# EAGLE design lisa_m (EAGLE 6.1)

## Sheet 1 of 3
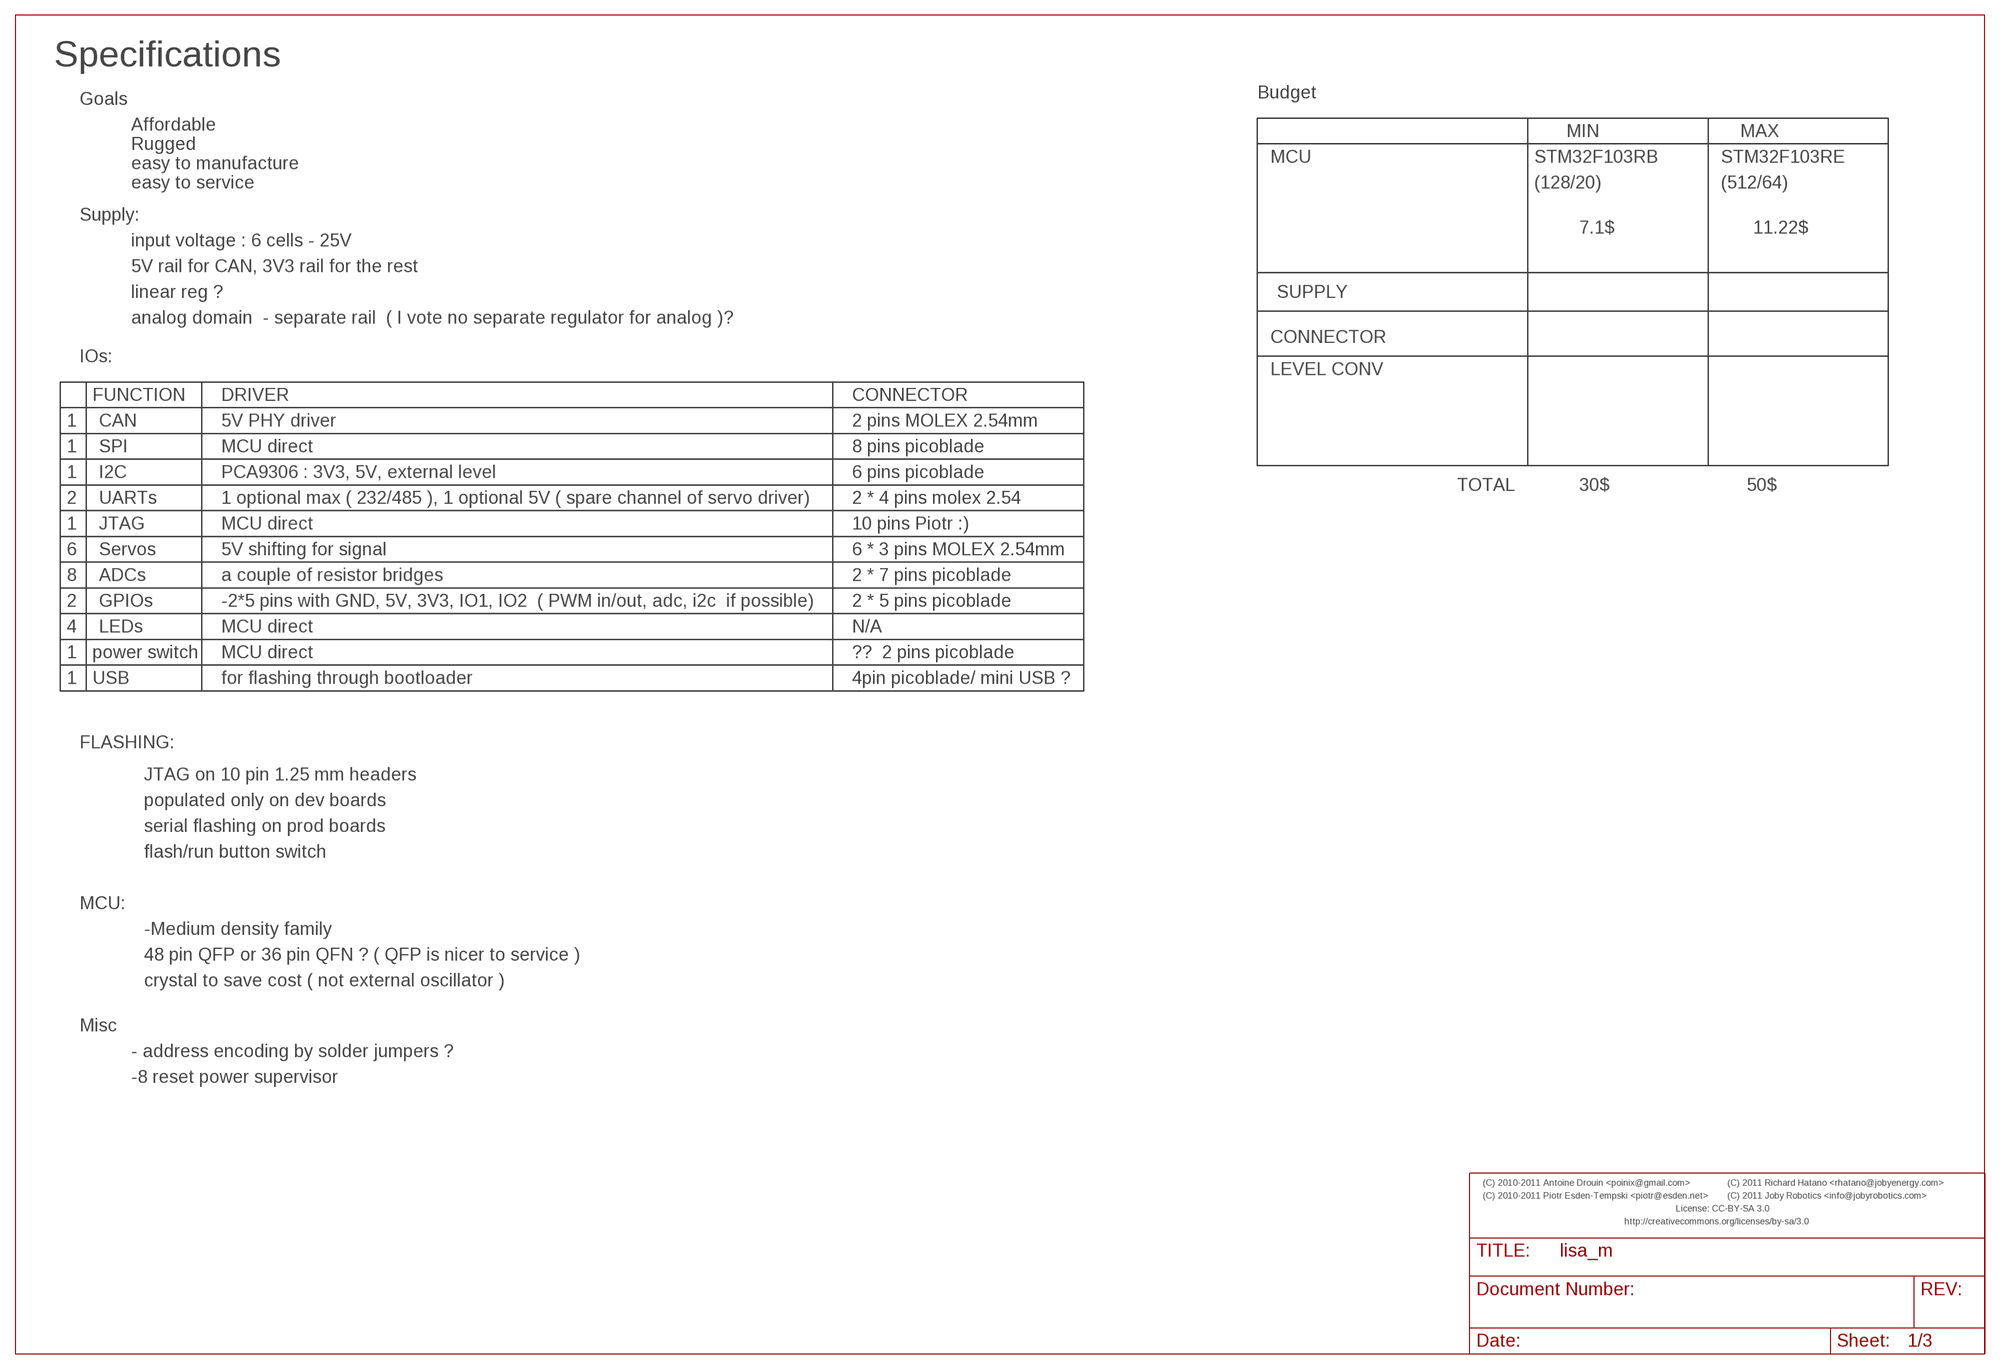
[diagram p0: schematic, sheet 1]

### Notes on the sheet
- Specifications
- Budget
- Goals
- Affordable
- MIN | MAX
- Rugged
- MCU | STM32F103RB | STM32F103RE
- easy to manufacture
- easy to service | (128/20) | (512/64)
- Supply:
- 7.1$ | 11.22$
- input voltage : 6 cells - 25V
- 5V rail for CAN, 3V3 rail for the rest
- linear reg ? | SUPPLY
- analog domain  - separate rail  ( I vote no separate regulator for analog )?
- CONNECTOR
- IOs:
- LEVEL CONV
- FUNCTION | DRIVER | CONNECTOR
- 1 | CAN | 5V PHY driver | 2 pins MOLEX 2.54mm
- 1 | SPI | MCU direct | 8 pins picoblade
- 1 | I2C | PCA9306 : 3V3, 5V, external level | 6 pins picoblade
- TOTAL | 30$ | 50$
- 2 | UARTs | 1 optional max ( 232/485 ), 1 optional 5V ( spare channel of servo driver) | 2 * 4 pins molex 2.54
- 1 | JTAG | MCU direct | 10 pins Piotr :)
- 6 | Servos | 5V shifting for signal | 6 * 3 pins MOLEX 2.54mm
- 8 | ADCs | a couple of resistor bridges | 2 * 7 pins picoblade
- 2 | GPIOs | -2*5 pins with GND, 5V, 3V3, IO1, IO2  ( PWM in/out, adc, i2c  if possible) | 2 * 5 pins picoblade
- 4 | LEDs | MCU direct | N/A
- 1 | power switch | MCU direct | ??  2 pins picoblade
- 1 | USB | for flashing through bootloader | 4pin picoblade/ mini USB ?
- FLASHING:
- JTAG on 10 pin 1.25 mm headers
- populated only on dev boards
- serial flashing on prod boards
- flash/run button switch
- MCU:
- -Medium density family
- 48 pin QFP or 36 pin QFN ? ( QFP is nicer to service )
- crystal to save cost ( not external oscillator )
- Misc
- - address encoding by solder jumpers ?
- -8 reset power supervisor
- (C) 2010-2011 Antoine Drouin <poinix@gmail.com> | (C) 2011 Richard Hatano <rhatano@jobyenergy.com>
- (C) 2010-2011 Piotr Esden-Tempski <piotr@esden.net> | (C) 2011 Joby Robotics <info@jobyrobotics.com>
- License: CC-BY-SA 3.0
- http://creativecommons.org/licenses/by-sa/3.0

## Sheet 2 of 3
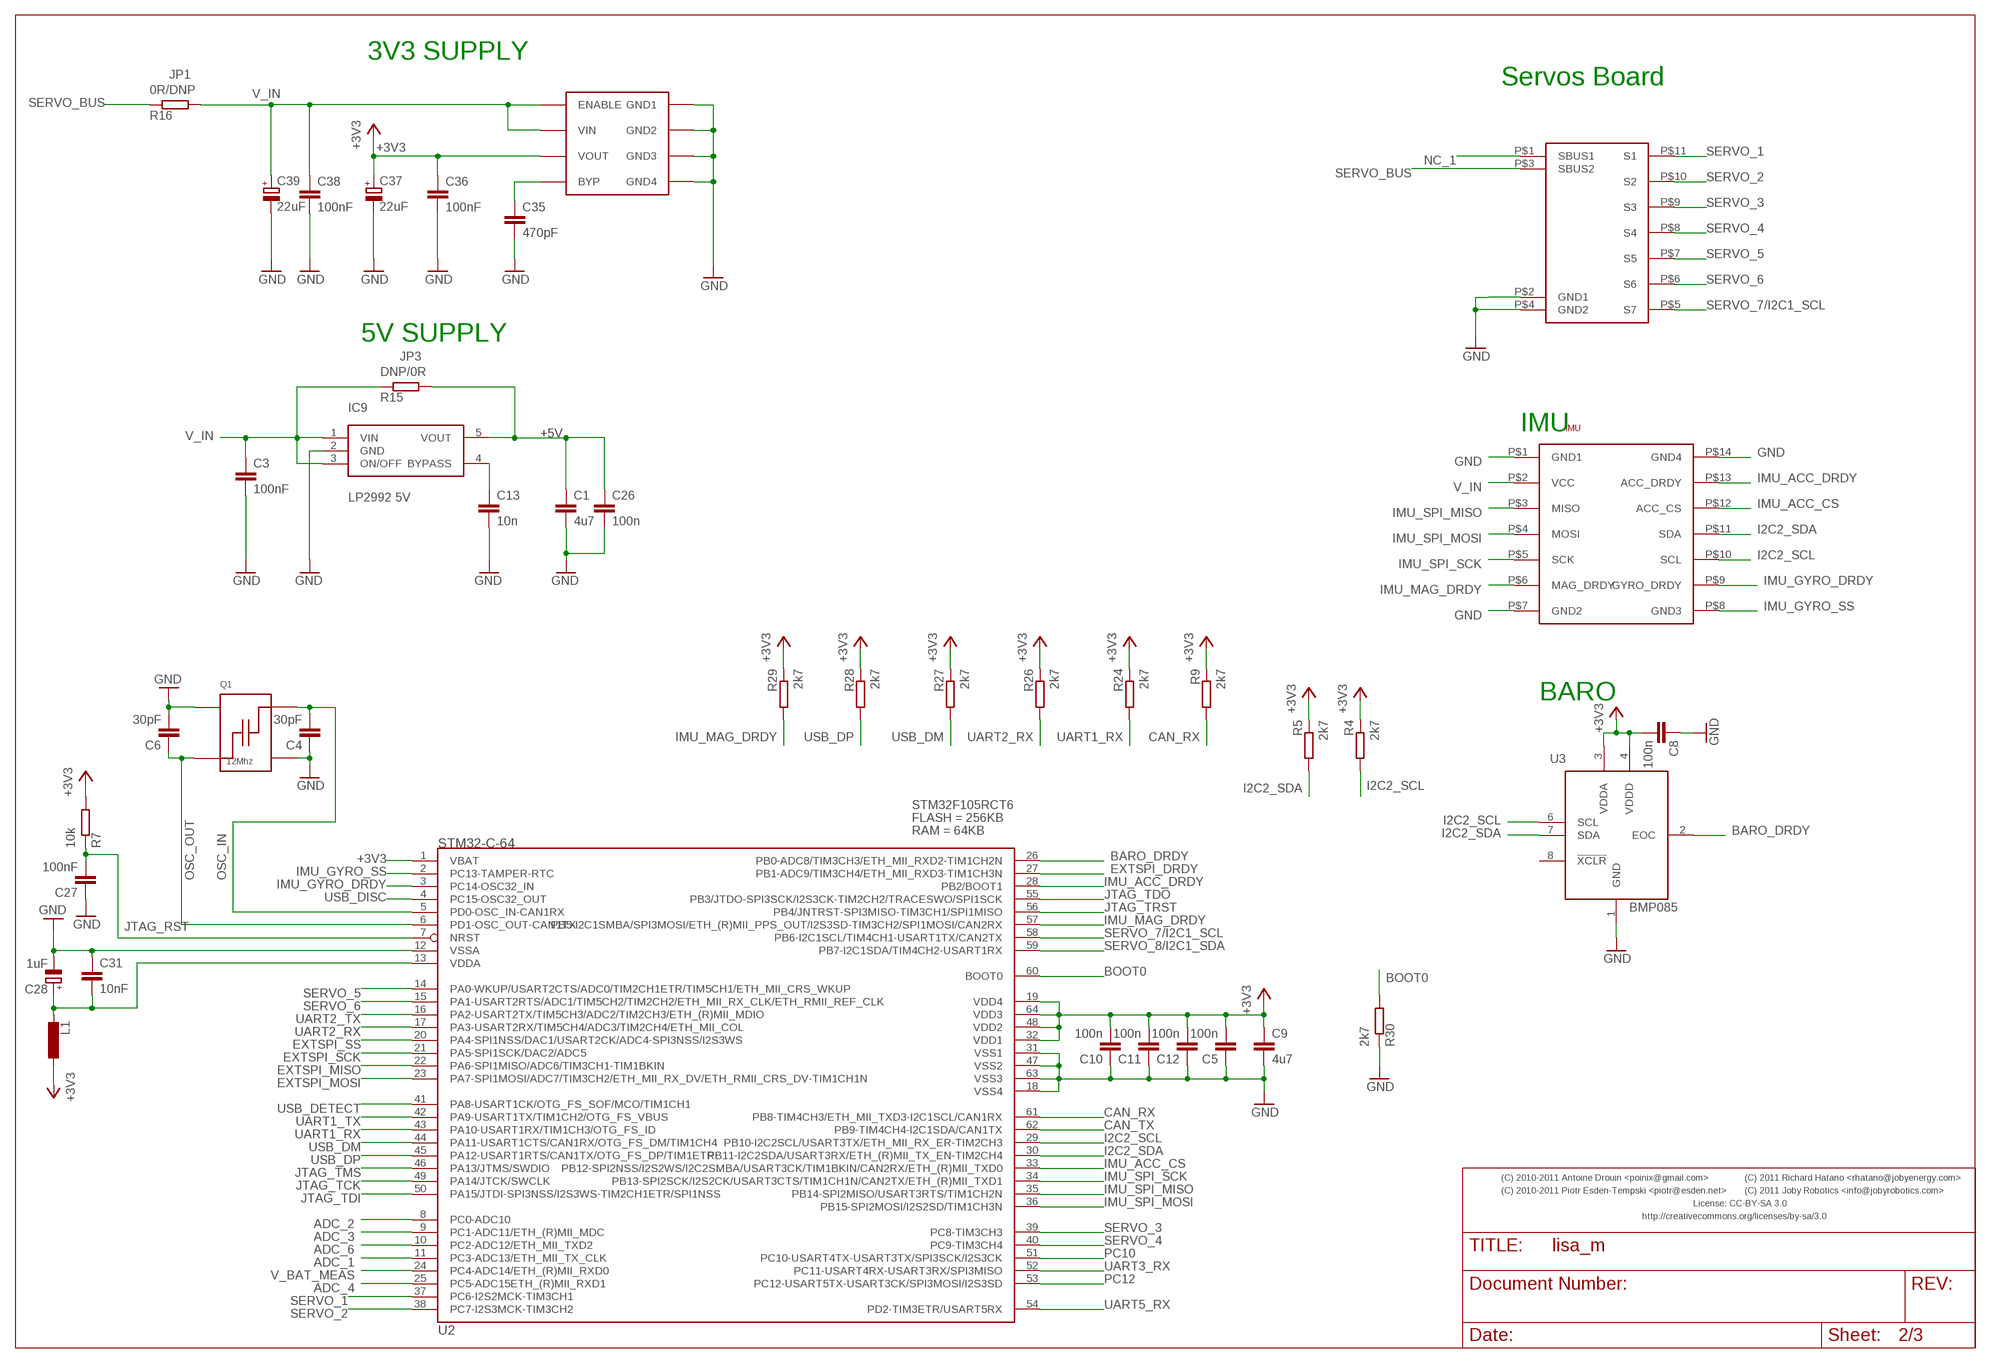
[diagram p1: schematic, sheet 2]

### Parts
C1  4u7  CAPACITOR-0805  [0805-CAP]
C3  100nF  CAPACITOR-0603  [0603-CAP]
C4  30pF  CAPACITOR-0402  [0402-CAP]
C5  100n  CAPACITOR-0402  [0402-CAP]
C6  30pF  CAPACITOR-0402  [0402-CAP]
C8  100n  CAPACITOR-0402  [0402-CAP]
C9  4u7  CAPACITOR-0805  [0805-CAP]
C10  100n  CAPACITOR-0402  [0402-CAP]
C11  100n  CAPACITOR-0402  [0402-CAP]
C12  100n  CAPACITOR-0402  [0402-CAP]
C13  10n  CAPACITOR-0402  [0402-CAP]
C26  100n  CAPACITOR-0603  [0603-CAP]
C27  100nF  CAPACITOR-0402  [0402-CAP]
C28  1uF  CAPACITOR-POL-0603  [0603-POL-CAP]
C31  10nF  CAPACITOR-0402  [0402-CAP]
C35  470pF  CAPACITOR-0402  [0402-CAP]
C36  100nF  CAPACITOR-0603  [0603-CAP]
C37  22uF  CAPACITOR-POLB  [3528/B]
C38  100nF  CAPACITOR-0402  [0402-CAP]
C39  22uF  CAPACITOR-POLB  [3528/B]
IC9  LP2992 5V  LP2992  [SOT23-5]
IMU  ASPIRIN  [ASPIRIN_1]
L1  INDUCTOR-0603  [0603-IND]
Q1  12Mhz  ABM8  [ABM8]
R4  2k7  RESISTOR-0402  [0402-RES]
R5  2k7  RESISTOR-0402  [0402-RES]
R7  10k  RESISTOR-0402  [0402-RES]
R9  2k7  RESISTOR-0402  [0402-RES]
R15  DNP/0R  RESISTOR-0402  [0402-RES]
R16  0R/DNP  RESISTOR-0402  [0402-RES]
R24  2k7  RESISTOR-0402  [0402-RES]
R26  2k7  RESISTOR-0402  [0402-RES]
R27  2k7  RESISTOR-0402  [0402-RES]
R28  2k7  RESISTOR-0402  [0402-RES]
R29  2k7  RESISTOR-0402  [0402-RES]
R30  2k7  RESISTOR-0402  [0402-RES]
U2  STM32-C-64  [LQFP64]
U3  BMP085  [LCC8]
U$1  LISA_M_VBOARD  [LISA_M_VBOARD]
VREG1  MIC5209  [SOIC8]

### Nets
+3V3: C5.P$2 C8.P$2 C9.P$1 C10.P$2 C11.P$2 C12.P$2 C36.P$1 C37.+ L1.P$1 R4.P$1 R5.P$1 R7.P$2 R9.P$1 R24.P$1 R26.P$1 R27.P$1 R28.P$1 R29.P$1 U2.1(VBAT) U2.19(VDD4) U2.32(VDD1) U2.48(VDD2) U2.64(VDD3) U3.3(VDDA) U3.4(VDDD) VREG1.3(VOUT) ; also sheet 3
+5V: C1.P$1 C26.P$1 IC9.5(VOUT) R15.P$2 ; also sheet 3
ADC_1: U2.11(PC3-ADC13/ETH_MII_TX_CLK) ; also sheet 3
ADC_2: U2.8(PC0-ADC10) ; also sheet 3
ADC_3: U2.9(PC1-ADC11/ETH_(R)MII_MDC) ; also sheet 3
ADC_4: U2.25(PC5-ADC15ETH_(R)MII_RXD1) ; also sheet 3
ADC_6: U2.10(PC2-ADC12/ETH_MII_TXD2) ; also sheet 3
BARO_DRDY: U2.26(PB0-ADC8/TIM3CH3/ETH_MII_RXD2-TIM1CH2N) U3.2(EOC)
BOOT0: R30.P$2 U2.60(BOOT0) ; also sheet 3
CAN_RX: R9.P$2 U2.61(PB8-TIM4CH3/ETH_MII_TXD3-I2C1SCL/CAN1RX) ; also sheet 3
CAN_TX: U2.62(PB9-TIM4CH4-I2C1SDA/CAN1TX) ; also sheet 3
EXTSPI_DRDY: U2.27(PB1-ADC9/TIM3CH4/ETH_MII_RXD3-TIM1CH3N) ; also sheet 3
EXTSPI_MISO: U2.22(PA6-SPI1MISO/ADC6/TIM3CH1-TIM1BKIN) ; also sheet 3
EXTSPI_MOSI: U2.23(PA7-SPI1MOSI/ADC7/TIM3CH2/ETH_MII_RX_DV/ETH_RMII_CRS_DV-TIM1CH1N) ; also sheet 3
EXTSPI_SCK: U2.21(PA5-SPI1SCK/DAC2/ADC5) ; also sheet 3
EXTSPI_SS: U2.20(PA4-SPI1NSS/DAC1/USART2CK/ADC4-SPI3NSS/I2S3WS) ; also sheet 3
GND: C1.P$2 C3.P$2 C4.P$1 C5.P$1 C6.P$2 C8.P$1 C9.P$2 C10.P$1 C11.P$1 C12.P$1 C13.P$2 C26.P$2 C27.P$1 C28.- C31.P$1 C35.P$2 C36.P$2 C37.- C38.P$2 C39.- IC9.2(GND) IMU.P$1(GND1) IMU.P$7(GND2) IMU.P$14(GND4) Q1.P$2 Q1.P$4 R30.P$1 U2.12(VSSA) U2.18(VSS4) U2.31(VSS1) U2.47(VSS2) U2.63(VSS3) U3.1(GND) U$1.P$2(GND1) U$1.P$4(GND2) VREG1.5(GND4) VREG1.6(GND3) VREG1.7(GND2) VREG1.8(GND1) ; also sheet 3
I2C2_SCL: IMU.P$10(SCL) R4.P$2 U2.29(PB10-I2C2SCL/USART3TX/ETH_MII_RX_ER-TIM2CH3) U3.6(SCL) ; also sheet 3
I2C2_SDA: IMU.P$11(SDA) R5.P$2 U2.30(PB11-I2C2SDA/USART3RX/ETH_(R)MII_TX_EN-TIM2CH4) U3.7(SDA) ; also sheet 3
IMU_ACC_CS: IMU.P$12(ACC_CS) U2.33(PB12-SPI2NSS/I2S2WS/I2C2SMBA/USART3CK/TIM1BKIN/CAN2RX/ETH_(R)MII_TXD0)
IMU_ACC_DRDY: IMU.P$13(ACC_DRDY) U2.28(PB2/BOOT1)
IMU_GYRO_DRDY: IMU.P$9(GYRO_DRDY) U2.3(PC14-OSC32_IN)
IMU_GYRO_SS: IMU.P$8(GND3) U2.2(PC13-TAMPER-RTC)
IMU_MAG_DRDY: IMU.P$6(MAG_DRDY) R29.P$2 U2.57(PB5-I2C1SMBA/SPI3MOSI/ETH_(R)MII_PPS_OUT/I2S3SD-TIM3CH2/SPI1MOSI/CAN2RX)
IMU_SPI_MISO: IMU.P$3(MISO) U2.35(PB14-SPI2MISO/USART3RTS/TIM1CH2N)
IMU_SPI_MOSI: IMU.P$4(MOSI) U2.36(PB15-SPI2MOSI/I2S2SD/TIM1CH3N)
IMU_SPI_SCK: IMU.P$5(SCK) U2.34(PB13-SPI2SCK/I2S2CK/USART3CTS/TIM1CH1N/CAN2TX/ETH_(R)MII_TXD1)
JTAG_RST: C27.P$2 R7.P$1 U2.7(NRST) ; also sheet 3
JTAG_TCK: U2.49(PA14/JTCK/SWCLK) ; also sheet 3
JTAG_TDI: U2.50(PA15/JTDI-SPI3NSS/I2S3WS-TIM2CH1ETR/SPI1NSS) ; also sheet 3
JTAG_TDO: U2.55(PB3/JTDO-SPI3SCK/I2S3CK-TIM2CH2/TRACESWO/SPI1SCK) ; also sheet 3
JTAG_TMS: U2.46(PA13/JTMS/SWDIO) ; also sheet 3
JTAG_TRST: U2.56(PB4/JNTRST-SPI3MISO-TIM3CH1/SPI1MISO) ; also sheet 3
N$6: C13.P$1 IC9.4(BYPASS)
N$7: C35.P$1 VREG1.4(BYP)
NC_1: U$1.P$1(SBUS1)
OSC_IN: C4.P$2 Q1.P$3 U2.5(PD0-OSC_IN-CAN1RX)
OSC_OUT: C6.P$1 Q1.P$1 U2.6(PD1-OSC_OUT-CAN1TX)
PC10: U2.51(PC10-USART4TX-USART3TX/SPI3SCK/I2S3CK) ; also sheet 3
PC12: U2.53(PC12-USART5TX-USART3CK/SPI3MOSI/I2S3SD) ; also sheet 3
SERVO_1: U2.37(PC6-I2S2MCK-TIM3CH1) U$1.P$11(S1)
SERVO_2: U2.38(PC7-I2S3MCK-TIM3CH2) U$1.P$10(S2)
SERVO_3: U2.39(PC8-TIM3CH3) U$1.P$9(S3)
SERVO_4: U2.40(PC9-TIM3CH4) U$1.P$8(S4)
SERVO_5: U2.14(PA0-WKUP/USART2CTS/ADC0/TIM2CH1ETR/TIM5CH1/ETH_MII_CRS_WKUP) U$1.P$7(S5)
SERVO_6: U2.15(PA1-USART2RTS/ADC1/TIM5CH2/TIM2CH2/ETH_MII_RX_CLK/ETH_RMII_REF_CLK) U$1.P$6(S6)
SERVO_7/I2C1_SCL: U2.58(PB6-I2C1SCL/TIM4CH1-USART1TX/CAN2TX) U$1.P$5(S7) ; also sheet 3
SERVO_8/I2C1_SDA: U2.59(PB7-I2C1SDA/TIM4CH2-USART1RX) ; also sheet 3
SERVO_BUS: R16.P$1 U$1.P$3(SBUS2)
UART1_RX: R24.P$2 U2.43(PA10-USART1RX/TIM1CH3/OTG_FS_ID) ; also sheet 3
UART1_TX: U2.42(PA9-USART1TX/TIM1CH2/OTG_FS_VBUS) ; also sheet 3
UART2_RX: R26.P$2 U2.17(PA3-USART2RX/TIM5CH4/ADC3/TIM2CH4/ETH_MII_COL) ; also sheet 3
UART2_TX: U2.16(PA2-USART2TX/TIM5CH3/ADC2/TIM2CH3/ETH_(R)MII_MDIO) ; also sheet 3
UART3_RX: U2.52(PC11-USART4RX-USART3RX/SPI3MISO) ; also sheet 3
UART5_RX: U2.54(PD2-TIM3ETR/USART5RX) ; also sheet 3
USB_DETECT: U2.41(PA8-USART1CK/OTG_FS_SOF/MCO/TIM1CH1) ; also sheet 3
USB_DISC: U2.4(PC15-OSC32_OUT) ; also sheet 3
USB_DM: R27.P$2 U2.44(PA11-USART1CTS/CAN1RX/OTG_FS_DM/TIM1CH4) ; also sheet 3
USB_DP: R28.P$2 U2.45(PA12-USART1RTS/CAN1TX/OTG_FS_DP/TIM1ETR) ; also sheet 3
V_BAT_MEAS: U2.24(PC4-ADC14/ETH_(R)MII_RXD0) ; also sheet 3
V_IN: C3.P$1 C38.P$1 C39.+ IC9.1(VIN) IC9.3(ON/OFF) IMU.P$2(VCC) R15.P$1 R16.P$2 VREG1.1(ENABLE) VREG1.2(VIN) ; also sheet 3
VDDA: C28.+ C31.P$2 L1.P$2 U2.13(VDDA)
Unconnected: U3.8(!XCLR)

### Notes on the sheet
- 3V3 SUPPLY
- JP1
- Servos Board
- 5V SUPPLY
- JP3
- IMU
- BARO
- (C) 2010-2011 Antoine Drouin <poinix@gmail.com> | (C) 2011 Richard Hatano <rhatano@jobyenergy.com>
- (C) 2010-2011 Piotr Esden-Tempski <piotr@esden.net> | (C) 2011 Joby Robotics <info@jobyrobotics.com>
- License: CC-BY-SA 3.0
- http://creativecommons.org/licenses/by-sa/3.0

## Sheet 3 of 3
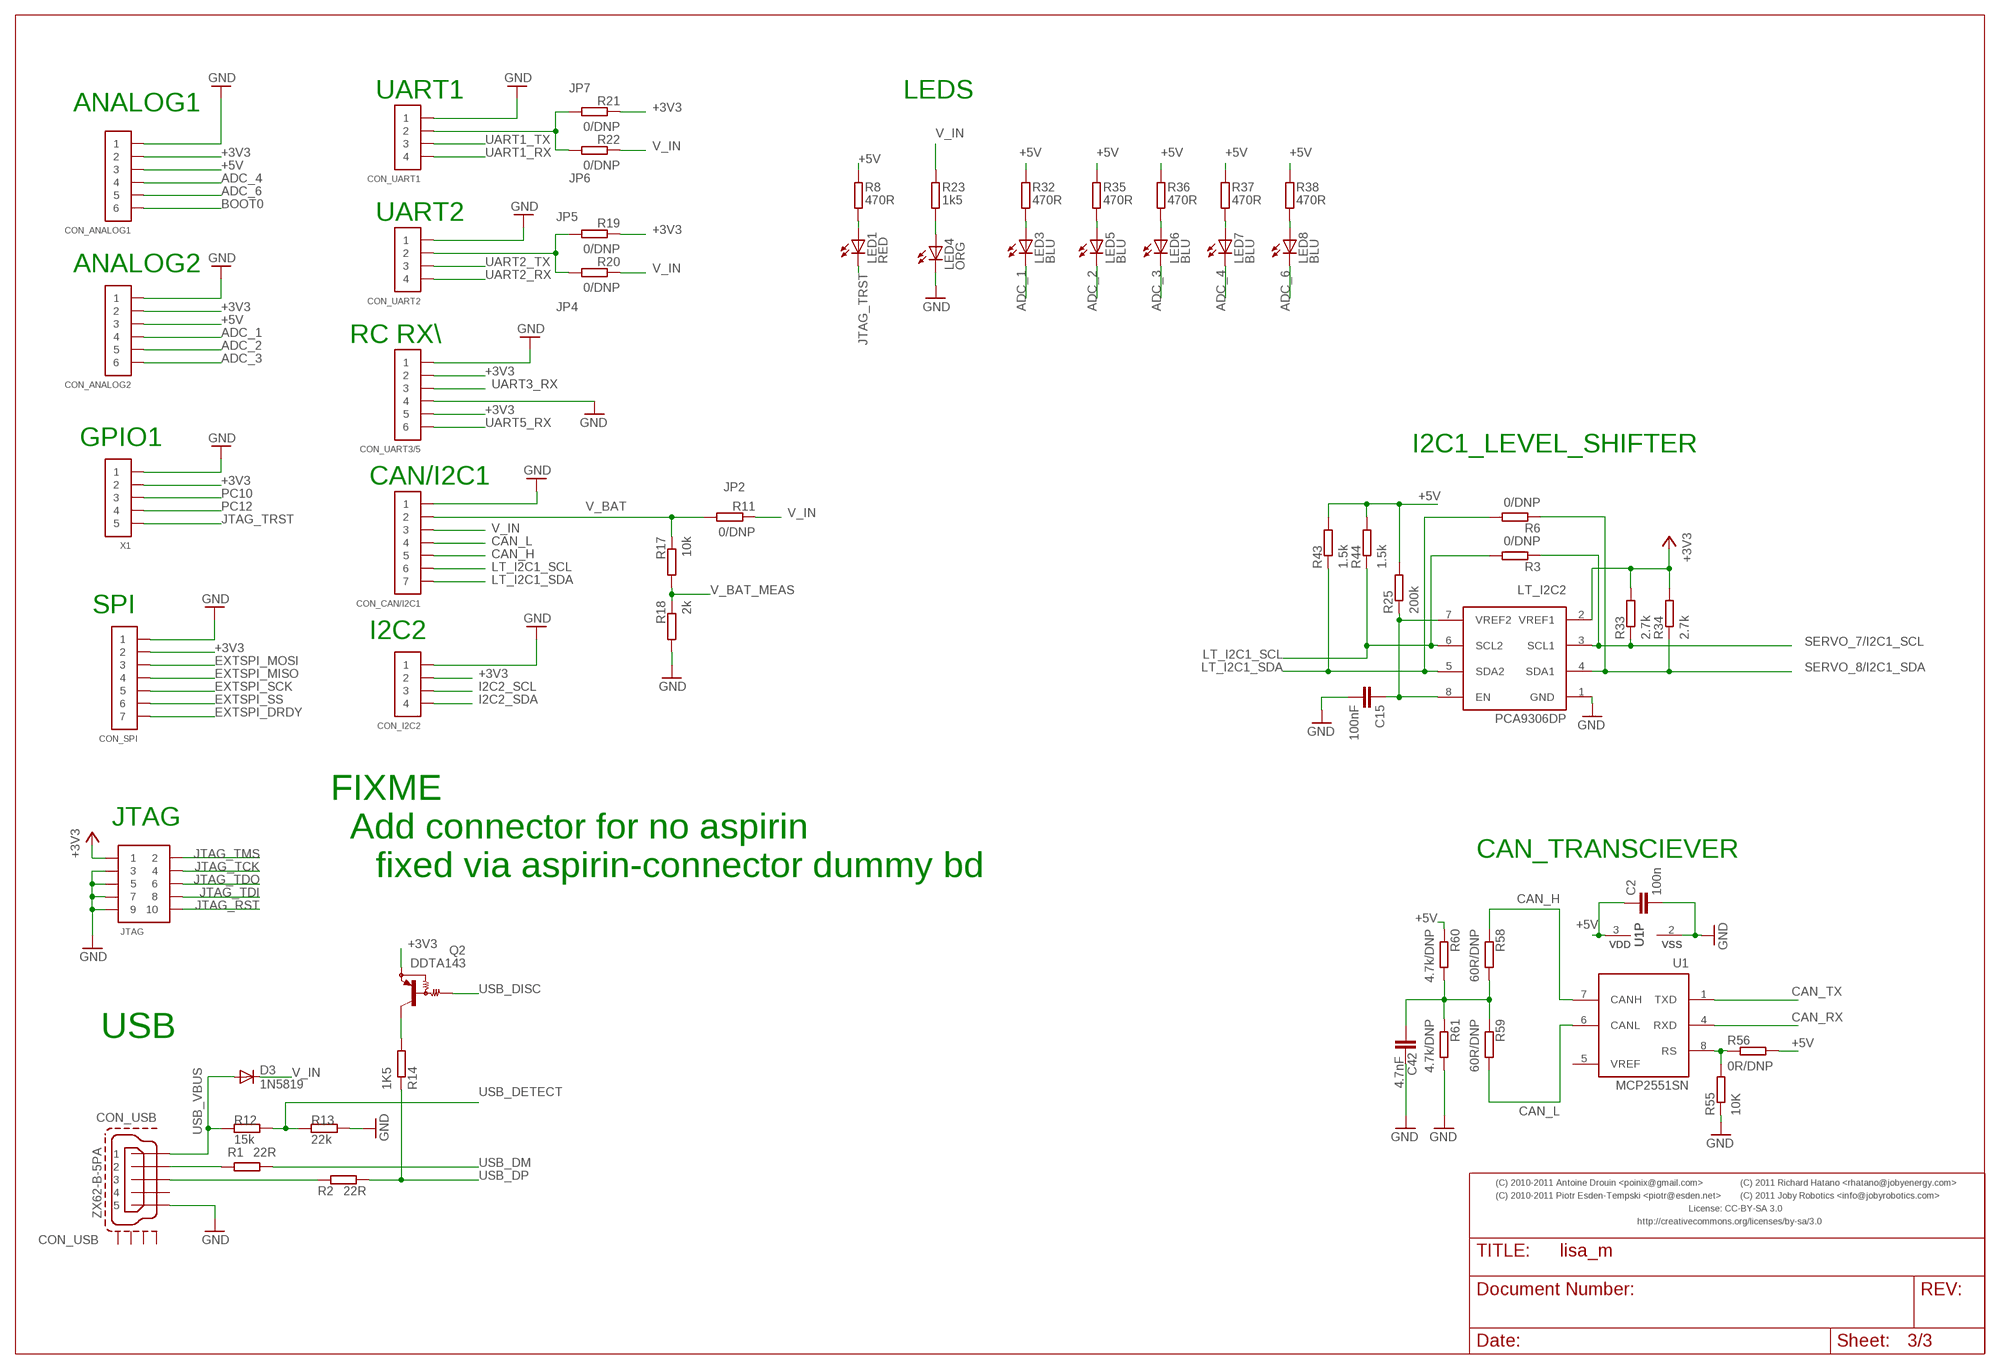
[diagram p2: schematic, sheet 3]

### Parts
C2  100n  CAPACITOR-0402  [0402-CAP]
C15  100nF  CAPACITOR-0402  [0402-CAP]
C42  4.7nF  CAPACITOR-0603  [0603-CAP]
CON_ANALOG1  CONN_6-1-53398  [PB-53398-06]
CON_ANALOG2  CONN_6-1-53398  [PB-53398-06]
CON_CAN/I2C1  CONN_7-1-53261  [PB-53261-07]
CON_I2C2  CONN_4-1-53398  [PB-53398-04]
CON_SPI  CONN_7-1-53398  [PB-53398-07]
CON_UART1  CONN_4-1-53398  [PB-53398-04]
CON_UART2  CONN_4-1-53398  [PB-53398-04]
CON_UART3/5  CONN_6-1PB-53398-06_SMALL  [PB-53398-06]
CON_USB  ZX62-B-5PA  [ZX62-B-5PA]
D3  1N5819  DIODE-MICROMELF-R  [MICROMELF-R]
JTAG  PIN_HDR_EDG_1.27MM_5-2  CONN_5-2-FTSH-V  [FTSH-105-DV]
LED1  RED  LED-0402  [0402-LED]
LED3  BLU  LED-0402  [0402-LED]
LED4  ORG  LED-0402  [0402-LED]
LED5  BLU  LED-0402  [0402-LED]
LED6  BLU  LED-0402  [0402-LED]
LED7  BLU  LED-0402  [0402-LED]
LED8  BLU  LED-0402  [0402-LED]
LT_I2C2  PCA9306DP  [TSSOP_B3]
Q2  DDTA143  MUN2111SOT23  [SOT23]
R1  22R  RESISTOR-0402  [0402-RES]
R2  22R  RESISTOR-0402  [0402-RES]
R3  0/DNP  RESISTOR-0603  [0603-RES]
R6  0/DNP  RESISTOR-0603  [0603-RES]
R8  470R  RESISTOR-0402  [0402-RES]
R11  0/DNP  RESISTOR-0402  [0402-RES]
R12  15k  RESISTOR-0402  [0402-RES]
R13  22k  RESISTOR-0402  [0402-RES]
R14  1K5  RESISTOR-0402  [0402-RES]
R17  10k  RESISTOR-0402  [0402-RES]
R18  2k  RESISTOR-0402  [0402-RES]
R19  0/DNP  RESISTOR-0402  [0402-RES]
R20  0/DNP  RESISTOR-0402  [0402-RES]
R21  0/DNP  RESISTOR-0402  [0402-RES]
R22  0/DNP  RESISTOR-0402  [0402-RES]
R23  1k5  RESISTOR-0402  [0402-RES]
R25  200k  RESISTOR-0402  [0402-RES]
R32  470R  RESISTOR-0402  [0402-RES]
R33  2.7k  RESISTOR-0402  [0402-RES]
R34  2.7k  RESISTOR-0402  [0402-RES]
R35  470R  RESISTOR-0402  [0402-RES]
R36  470R  RESISTOR-0402  [0402-RES]
R37  470R  RESISTOR-0402  [0402-RES]
R38  470R  RESISTOR-0402  [0402-RES]
R43  1.5k  RESISTOR-0402  [0402-RES]
R44  1.5k  RESISTOR-0402  [0402-RES]
R55  10K  RESISTOR-0402  [0402-RES]
R56  0R/DNP  RESISTOR-0402  [0402-RES]
R58  60R/DNP  RESISTOR-0402  [0402-RES]
R59  60R/DNP  RESISTOR-0402  [0402-RES]
R60  4.7k/DNP  RESISTOR-0402  [0402-RES]
R61  4.7k/DNP  RESISTOR-0402  [0402-RES]
U1  MCP2551SN  [SO-08]
X1  CONN_5-1-53398  [PB-53398-05]

### Nets
+3V3: CON_ANALOG1.2 CON_ANALOG2.2 CON_I2C2.2 CON_SPI.2 CON_UART3/5.2 CON_UART3/5.5 JTAG.1 LT_I2C2.2(VREF1) Q2.2(E) R19.P$1 R21.P$1 R33.P$2 R34.P$2 X1.2 ; also sheet 2
+5V: C2.P$1 CON_ANALOG1.3 CON_ANALOG2.3 R8.P$2 R25.P$2 R32.P$2 R35.P$2 R36.P$2 R37.P$2 R38.P$2 R43.P$2 R44.P$2 R56.P$2 R60.P$1 U1.3(VDD) ; also sheet 2
ADC_1: CON_ANALOG2.4 LED3.C ; also sheet 2
ADC_2: CON_ANALOG2.5 LED5.C ; also sheet 2
ADC_3: CON_ANALOG2.6 LED6.C ; also sheet 2
ADC_4: CON_ANALOG1.4 LED7.C ; also sheet 2
ADC_6: CON_ANALOG1.5 LED8.C ; also sheet 2
BOOT0: CON_ANALOG1.6 ; also sheet 2
CAN_CENTER: C42.P$2 R58.P$2 R59.P$1 R60.P$2 R61.P$1
CAN_H: CON_CAN/I2C1.5 R58.P$1 U1.7(CANH)
CAN_L: CON_CAN/I2C1.4 R59.P$2 U1.6(CANL)
CAN_RX: U1.4(RXD) ; also sheet 2
CAN_TX: U1.1(TXD) ; also sheet 2
EXTSPI_DRDY: CON_SPI.7 ; also sheet 2
EXTSPI_MISO: CON_SPI.4 ; also sheet 2
EXTSPI_MOSI: CON_SPI.3 ; also sheet 2
EXTSPI_SCK: CON_SPI.5 ; also sheet 2
EXTSPI_SS: CON_SPI.6 ; also sheet 2
FT_USB_DM: CON_USB.PIN_2 R1.P$1
FT_USB_DP: CON_USB.PIN_3 R2.P$1
GND: C2.P$2 C15.P$2 C42.P$1 CON_ANALOG1.1 CON_ANALOG2.1 CON_CAN/I2C1.1 CON_I2C2.1 CON_SPI.1 CON_UART1.1 CON_UART2.1 CON_UART3/5.1 CON_UART3/5.4 CON_USB.PIN_5 JTAG.3 JTAG.5 JTAG.7 JTAG.9 LED4.C LT_I2C2.1(GND) R13.P$2 R18.P$2 R55.P$1 R61.P$2 U1.2(VSS) X1.1 ; also sheet 2
I2C2_SCL: CON_I2C2.3 ; also sheet 2
I2C2_SDA: CON_I2C2.4 ; also sheet 2
JTAG_RST: JTAG.10 ; also sheet 2
JTAG_TCK: JTAG.4 ; also sheet 2
JTAG_TDI: JTAG.8 ; also sheet 2
JTAG_TDO: JTAG.6 ; also sheet 2
JTAG_TMS: JTAG.2 ; also sheet 2
JTAG_TRST: LED1.C X1.5 ; also sheet 2
LT_I2C1_SCL: CON_CAN/I2C1.6 LT_I2C2.6(SCL2) R3.P$2 R44.P$1
LT_I2C1_SDA: CON_CAN/I2C1.7 LT_I2C2.5(SDA2) R6.P$2 R43.P$1
N$1: R55.P$2 R56.P$1 U1.8(RS)
N$2: CON_UART2.2 R19.P$2 R20.P$2
N$3: CON_UART1.2 R21.P$2 R22.P$2
N$5: LED3.A R32.P$1
N$8: C15.P$1 LT_I2C2.7(VREF2) LT_I2C2.8(EN) R25.P$1
N$9: LED5.A R35.P$1
N$10: LED1.A R8.P$1
N$11: LED6.A R36.P$1
N$12: LED4.A R23.P$1
N$13: Q2.3(C) R14.P$2
N$14: LED7.A R37.P$1
N$15: LED8.A R38.P$1
PC10: X1.3 ; also sheet 2
PC12: X1.4 ; also sheet 2
SERVO_7/I2C1_SCL: LT_I2C2.3(SCL1) R3.P$1 R33.P$1 ; also sheet 2
SERVO_8/I2C1_SDA: LT_I2C2.4(SDA1) R6.P$1 R34.P$1 ; also sheet 2
UART1_RX: CON_UART1.4 ; also sheet 2
UART1_TX: CON_UART1.3 ; also sheet 2
UART2_RX: CON_UART2.4 ; also sheet 2
UART2_TX: CON_UART2.3 ; also sheet 2
UART3_RX: CON_UART3/5.3 ; also sheet 2
UART5_RX: CON_UART3/5.6 ; also sheet 2
USB_DETECT: R12.P$2 R13.P$1 ; also sheet 2
USB_DISC: Q2.1(B) ; also sheet 2
USB_DM: R1.P$2 ; also sheet 2
USB_DP: R2.P$2 R14.P$1 ; also sheet 2
USB_VBUS: CON_USB.PIN_1 D3.A R12.P$1
V_BAT: CON_CAN/I2C1.2 R11.P$2 R17.P$1
V_BAT_MEAS: R17.P$2 R18.P$1 ; also sheet 2
V_IN: CON_CAN/I2C1.3 D3.C R11.P$1 R20.P$1 R22.P$1 R23.P$2 ; also sheet 2
Unconnected: CON_USB.GND_LEFT(S1) CON_USB.GND_RIGHT(S2) CON_USB.GND_UP_LEFT(S3) CON_USB.GND_UP_RIGHT(S4) CON_USB.PIN_4

### Notes on the sheet
- ANALOG1 | UART1 | JP7 | LEDS
- JP6
- UART2 | JP5
- ANALOG2
- JP4
- RC RX\
- GPIO1 | I2C1_LEVEL_SHIFTER
- CAN/I2C1
- JP2
- SPI
- I2C2
- FIXME
- JTAG
- Add connector for no aspirin
- CAN_TRANSCIEVER
- fixed via aspirin-connector dummy bd
- USB
- (C) 2010-2011 Antoine Drouin <poinix@gmail.com> | (C) 2011 Richard Hatano <rhatano@jobyenergy.com>
- (C) 2010-2011 Piotr Esden-Tempski <piotr@esden.net> | (C) 2011 Joby Robotics <info@jobyrobotics.com>
- License: CC-BY-SA 3.0
- http://creativecommons.org/licenses/by-sa/3.0

## Power pins joined to a net without a drawn wire
VREF: U1.5(VREF)

## Library data of the parts
C1-C6 C8-C13 C15 C26 C27 C31 C35 C36 C38 C42 = pel_dipol_comp:CAPACITOR
C28 C37 C39 = pel_dipol_comp:CAPACITOR-POL
CON_ANALOG1 CON_ANALOG2 = pel_molex:CONN_6-1
CON_CAN/I2C1 CON_SPI = pel_molex:CONN_7-1
CON_I2C2 CON_UART1 CON_UART2 = pel_molex:CONN_4-1
CON_UART3/5 = joby_robotics:CONN_6-1: molex con with reduced size landing pads to allow routing 6 mil tracks between them
CON_USB = open-bldc:ZX62-B-5PA
D3 = diode:DIODE-: DIODE
IC9 = open-bldc:LP2992
IMU = joby_robotics:ASPIRIN
JTAG = pel_misc:CONN_5-2
L1 = res_cap:INDUCTOR
LED1 LED3-LED8 = pel_dipol_comp:LED
LT_I2C2 = booz:PCA9306: Dual bidirectional I2C-bus and SMBus voltage-level translator
Q1 = booz:ABM8
Q2 = transistor-pnp:MUN2111*: PNP Bias Resistor Transistor
R1-R9 R11-R30 R32-R38 R43 R44 R55 R56 R58-R61 = pel_dipol_comp:RESISTOR
U1 = microchip_can:MCP2551: High Speed CAN tranceiver
U2 = pel_stm32:STM32-C-64; FLASH: 256KB; PART_NR: STM32F105RCT6; RAM: 64KB
U3 = omc:BMP085: BMP085 - Digital pressure sensor - Temperature measurement included - I2C interface - Fully calibrated Datasheet <http://www.sparkfun.com/datasheets/Components/General/BST-BMP085-DS000-05.pdf>
U$1 = joby_robotics:LISA_M_VBOARD
VREG1 = paparazzi:MIC5209
X1 = pel_molex:CONN_5-1

## Net classes
0 default: width 0.152 mm, drill 0.305 mm, clearance 0.152 mm

## Board
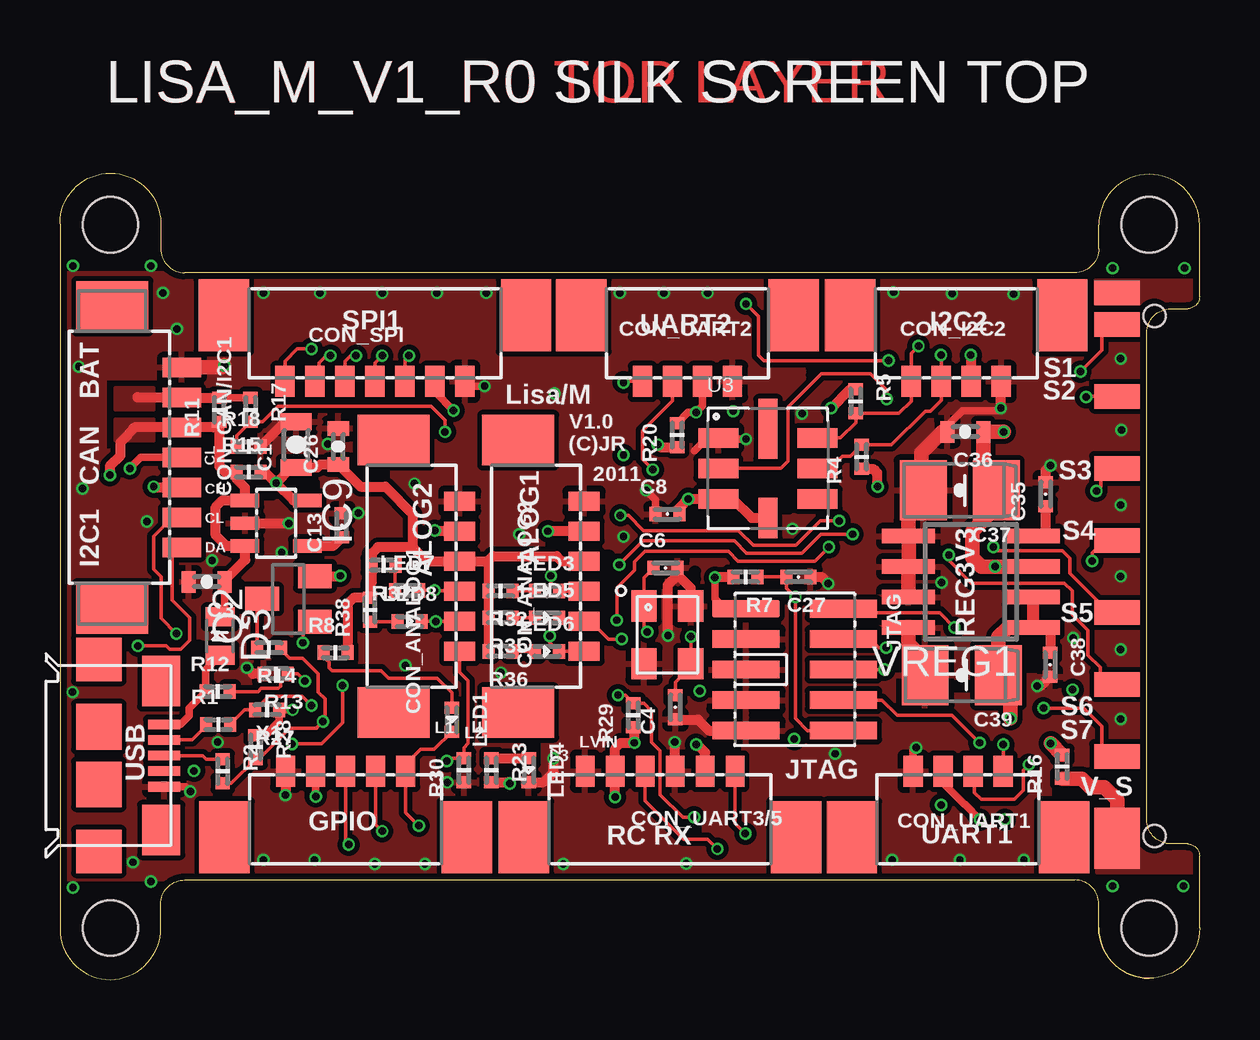
[diagram p3: board, top side]
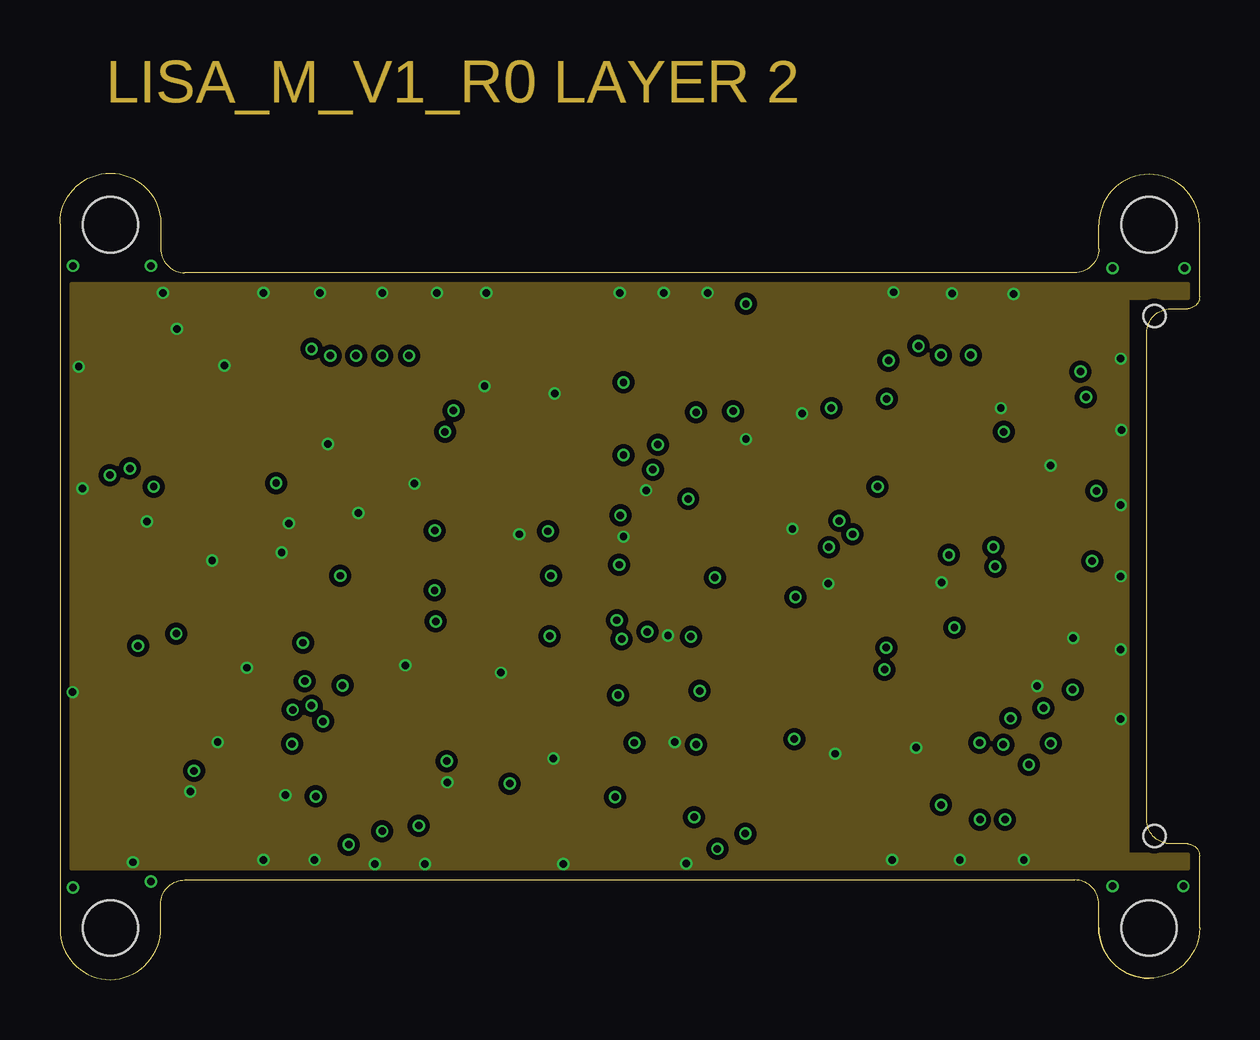
[diagram p4: board, inner layer Route2]
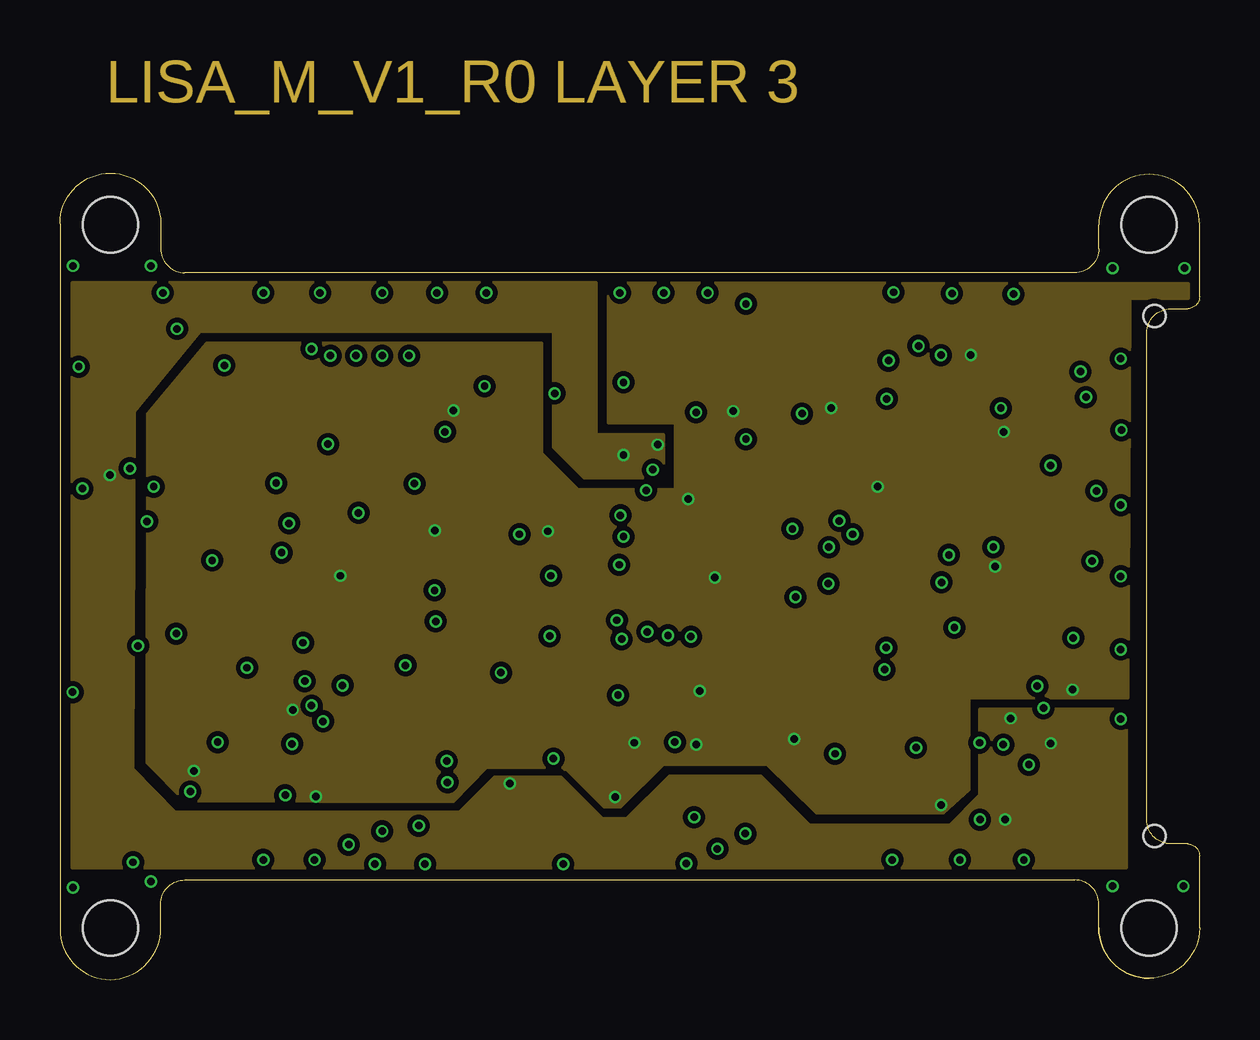
[diagram p5: board, inner layer Route15]
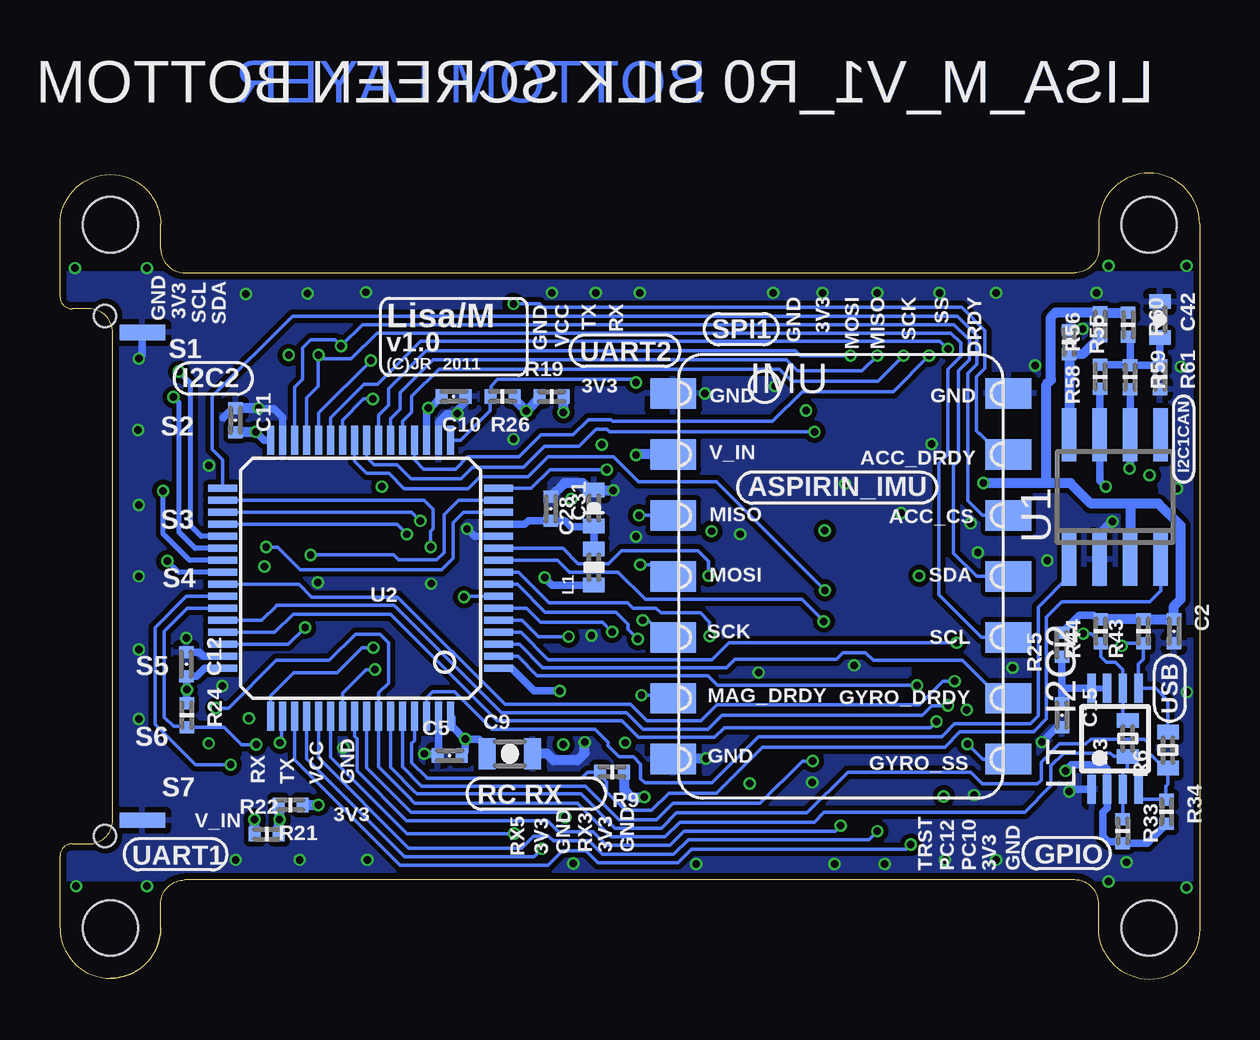
[diagram p6: board, bottom side, seen from below]

Size 47.5 x 33.6 mm. Coordinates in mm from the lower left corner, seen from the top.
Outline: 43.3,2.15 arc90 45.4,0.05
Outline: 45.4,0.05 arc-90 43.3,2.15
Outline: 43.3,2.15 43.3,3.15 arc90 42.3,4.15 5.2,4.15 arc90 4.2,3.15 4.2,2.15 arc-90 2.1,0 arc-90 0,2.1 0,31.5 arc-90 2.1,33.6 arc-90 4.2,31.5 4.2,30.45 arc90 5.2,29.45 42.3,29.45 arc90 43.3,30.45 43.3,31.45 arc-90 45.4,33.55 arc-90 47.5,31.45 47.5,28.45 arc-90 47,27.95 46.3,27.95 arc90 45.3,26.95 45.3,6.65 arc90 46.3,5.65 47,5.65 arc-90 47.5,5.15 47.5,2.15 arc-90 45.4,0.05
Copper layers (1*2+15*16): Top 0.035mm / dielectric 0.2mm / Route2 0.035mm / dielectric 1.5mm / Route15 0.035mm / dielectric 0.2mm / Bottom 0.035mm
Design rules: minimum track width 0.15mm, minimum drill 0.3mm, track to track 0.15mm, track to pad 0.15mm, pad to pad 0.15mm, via to via 0.15mm, smd to smd 0.15mm, copper to edge 10mil, drill to drill 8mil, minimum pad ring 0.1mm, minimum via ring 0.1mm, stop-mask expansion 14mil, vias tented up to drill 0.31mm, thermal gap 10mil
Holes 0.91 mm at 45.62,27.65 45.62,5.98
Holes 2.3 mm at 2.1,2.15 2.1,31.45 45.4,31.45 45.4,2.15
tKeepout: area 0.1,0.2 to 4.1,4.2; area 43.4,0.2 to 47.4,4.2; area 0.1,29.5 to 4.1,33.5; area 43.4,29.5 to 47.4,33.5
tRestrict: area 41.6,15.2 to 41.7,15.4; area 39.5,15.1 to 39.6,15.5; area 40.3,20.3 to 40.6,20.3; area 27.3,23.2 to 27.6,23.3; area 37.3,12.2 to 37.8,12.3; area 31.3,25.2 to 31.4,25.5; area 26.4,16.7 to 26.5,17; area 41.6,7.7 to 41.7,7.8; area 24.9,16.4 to 25,16.6; area 7.4,16.3 to 7.5,16.5; area 13.2,21 to 13.5,21.1; area 19.5,9.7 to 19.8,9.8; 15 more areas
bRestrict: area 2.3,26.9 to 2.5,27; area 2,20.3 to 2.1,20.5; area 2.2,24.5 to 2.3,24.7; area 7.9,23.5 to 8.1,23.6; area 3.5,16.8 to 3.6,17; area 4.8,16.8 to 4.9,17; area 0.4,14.5 to 0.5,14.6; area 5.1,10.4 to 5.2,10.6; area 11.7,12.8 to 11.8,13; area 40.1,9.4 to 40.2,9.6; area 27.5,20 to 27.6,20.2; area 30.5,24.7 to 30.7,24.9; 6 more areas

### Footprints (pad centres in the part's own frame; a part is rotated, then mirrored left to right if it is on the bottom)
0805-CAP = smd 0.7 x 1.3: P$1 -0.95,0; P$2 0.95,0
0402-CAP = smd 0.5 x 0.6: P$1 -0.5,0; P$2 0.5,0
0603-CAP = smd 0.6 x 0.9: P$1 -0.75,0; P$2 0.75,0
0603-POL-CAP = smd 0.6 x 0.9: + -0.75,0; - 0.75,0
3528/B = smd 1.95 x 2.5: + -1.525,0; - 1.525,0
PB-53398-06 = smd 0.8 x 1.3: 1 -3.125,1.25; 2 -1.875,1.25; 3 -0.625,1.25; 4 0.625,1.25; 5 1.875,1.25; 6 3.125,1.25 | smd 2.1 x 3: PAD1 -5.675,-1.5; PAD2 5.675,-1.5
PB-53261-07 = smd 0.8 x 1.6: 1 -3.75,1.1; 2 -2.5,1.1; 3 -1.25,1.1; 4 0,1.1; 5 1.25,1.1; 6 2.5,1.1; 7 3.75,1.1 | smd 2.1 x 3: MNT1 -6.3,-1.8; MNT2 6.3,-1.8
PB-53398-04 = smd 0.8 x 1.3: 1 -1.875,1.25; 2 -0.625,1.25; 3 0.625,1.25; 4 1.875,1.25 | smd 2.1 x 3: PAD1 -4.425,-1.5; PAD2 4.425,-1.5
PB-53398-07 = smd 0.8 x 1.3: 1 -3.75,1.25; 2 -2.5,1.25; 3 -1.25,1.25; 4 0,1.25; 5 1.25,1.25; 6 2.5,1.25; 7 3.75,1.25 | smd 2.1 x 3: PAD1 -6.3,-1.5; PAD2 6.3,-1.5
PB-53398-06' = smd 0.775 x 1.3: 1 -3.125,1.25; 2 -1.875,1.25; 3 -0.625,1.25; 4 0.625,1.25; 5 1.875,1.25; 6 3.125,1.25 | smd 2.1 x 3: PAD1 -5.675,-1.5; PAD2 5.675,-1.5
ZX62-B-5PA = smd 1.8 x 1.9: GND_LEFT -4,0; GND_RIGHT 4,0 | smd 1.9 x 1.9: GND_MID_LEFT -1.2,0; GND_MID_RIGHT 1.2,0 | smd 2.1 x 1.6: GND_UP_LEFT -3.1,2.6; GND_UP_RIGHT 3.1,2.6 | smd 0.4 x 1.35: PIN_1 -1.3,2.725; PIN_2 -0.65,2.725; PIN_3 0,2.725; PIN_4 0.65,2.725; PIN_5 1.3,2.725
MICROMELF-R = smd 0.8 x 1.2: A 0.8,0; C -0.8,0
SOT23-5 = smd 0.55 x 1.2: 1 -0.95,-1.3; 2 0,-1.3; 3 0.95,-1.3; 4 0.95,1.3; 5 -0.95,1.3
ASPIRIN_1 = smd 1.905 x 1.27: P$1 -6.985,7.62; P$2 -6.985,5.08; P$3 -6.985,2.54; P$4 -6.985,0; P$5 -6.985,-2.54; P$6 -6.985,-5.08; P$7 -6.985,-7.62; P$8 6.985,-7.62; P$9 6.985,-5.08; P$10 6.985,-2.54; P$11 6.985,0; P$12 6.985,2.54; P$13 6.985,5.08; P$14 6.985,7.62
FTSH-105-DV = smd 0.74 x 2.8: 1 -2.54,-2.03; 2 -2.54,2.03; 3 -1.27,-2.03; 4 -1.27,2.03; 5 0,-2.03; 6 0,2.03; 7 1.27,-2.03; 8 1.27,2.03; 9 2.54,-2.03; 10 2.54,2.03
0603-IND = smd 0.6 x 0.9: P$1 -0.75,0; P$2 0.75,0
0402-LED = smd 0.5 x 0.6: A -0.5,0; C 0.5,0
TSSOP_B3 = smd 1.2 x 0.35: 1 -2.925,0.975; 2 -2.925,0.325; 3 -2.925,-0.325; 4 -2.925,-0.975; 5 1.275,-0.975; 6 1.275,-0.325; 7 1.275,0.325; 8 1.275,0.975
ABM8 = smd 1.3 x 1.05: P$1 -1.2,-0.975; P$2 1.2,-0.975; P$3 1.2,0.975; P$4 -1.2,0.975
SOT23 = smd 1 x 1.4: 1 -0.95,-1.1; 2 0.95,-1.1; 3 0,1.1
0402-RES = smd 0.5 x 0.6: P$1 -0.5,0; P$2 0.5,0
0603-RES = smd 0.6 x 0.9: P$1 -0.75,0; P$2 0.75,0
SO-08 = smd 0.6 x 2.2: 1 -1.905,-2.6; 2 -0.635,-2.6; 3 0.635,-2.6; 4 1.905,-2.6; 5 1.905,2.6; 6 0.635,2.6; 7 -0.635,2.6; 8 -1.905,2.6
LQFP64 = smd 1.2 x 0.3: 1 -5.75,3.75; 2 -5.75,3.25; 3 -5.75,2.75; 4 -5.75,2.25; 5 -5.75,1.75; 6 -5.75,1.25; 7 -5.75,0.75; 8 -5.75,0.25; 9 -5.75,-0.25; 10 -5.75,-0.75; 11 -5.75,-1.25; 12 -5.75,-1.75; 13 -5.75,-2.25; 14 -5.75,-2.75; 15 -5.75,-3.25; 16 -5.75,-3.75; 33 5.75,-3.75; 34 5.75,-3.25; 35 5.75,-2.75; 36 5.75,-2.25; 37 5.75,-1.75; 38 5.75,-1.25; 39 5.75,-0.75; 40 5.75,-0.25; 41 5.75,0.25; 42 5.75,0.75; 43 5.75,1.25; 44 5.75,1.75; 45 5.75,2.25; 46 5.75,2.75; 47 5.75,3.25; 48 5.75,3.75 | smd 0.3 x 1.2: 17 -3.75,-5.75; 18 -3.25,-5.75; 19 -2.75,-5.75; 20 -2.25,-5.75; 21 -1.75,-5.75; 22 -1.25,-5.75; 23 -0.75,-5.75; 24 -0.25,-5.75; 25 0.25,-5.75; 26 0.75,-5.75; 27 1.25,-5.75; 28 1.75,-5.75; 29 2.25,-5.75; 30 2.75,-5.75; 31 3.25,-5.75; 32 3.75,-5.75; 49 3.75,5.75; 50 3.25,5.75; 51 2.75,5.75; 52 2.25,5.75; 53 1.75,5.75; 54 1.25,5.75; 55 0.75,5.75; 56 0.25,5.75; 57 -0.25,5.75; 58 -0.75,5.75; 59 -1.25,5.75; 60 -1.75,5.75; 61 -2.25,5.75; 62 -2.75,5.75; 63 -3.25,5.75; 64 -3.75,5.75
LCC8 = smd 1.67 x 0.8: 1 -2.065,1.27; 2 -2.065,0; 3 -2.065,-1.27; 5 2.065,-1.27; 6 2.065,0; 7 2.065,1.27 | smd 0.8 x 1.67: 4 0,-2.065 | smd 0.8 x 2.5: 8 0,1.65
LISA_M_VBOARD = smd 1.905 x 1.016: P$1 -1.905,11.811; P$5 -1.905,-7.5; P$6 -1.905,-4.5; P$7 -1.905,-1.5; P$8 -1.905,1.5; P$9 -1.905,4.5; P$10 -1.905,7.5; P$11 -1.905,10.5 | smd 1.905 x 0.635 bottom: P$2 -1.905,10.16; P$4 -1.905,-10.16 | smd 1.905 x 2.54: P$3 -1.905,-10.922
SOIC8 = smd 0.6 x 2.2: 1 -1.905,-2.6; 2 -0.635,-2.6; 3 0.635,-2.6; 4 1.905,-2.6; 5 1.905,2.6; 6 0.635,2.6; 7 -0.635,2.6; 8 -1.905,2.6
PB-53398-05 = smd 0.8 x 1.3: 1 -2.5,1.25; 2 -1.25,1.25; 3 0,1.25; 4 1.25,1.25; 5 2.5,1.25 | smd 2.1 x 3: PAD1 -5.05,-1.5; PAD2 5.05,-1.5

### Placement (x,y rotation side)
C1  9.85,22.29 90 top
C2  1.07,14.51 270 bottom
C3  6.12,16.57 180 top
C4  25.65,11.34 90 top
C5  31.26,9.33 0 bottom
C6  25.25,17.15 0 top
C8  25.32,19.39 0 top
C9  28.75,9.41 0 bottom
C10  31.08,24.29 180 bottom
C11  40.18,23.31 270 bottom
C12  42.23,13.14 270 bottom
C13  11.75,18.93 90 top
C15  5.73,11.01 270 bottom
C26  11.6,22.21 90 top
C27  30.79,16.77 180 top
C28  25.24,19.64 90 bottom
C31  27.05,19.62 270 bottom
C35  41.09,20.23 90 top
C36  37.74,22.82 180 top
C37  37.51,20.38 180 top
C38  41.27,13.12 270 top
C39  37.59,12.68 180 top
C42  1.65,27.5 270 bottom
CON_ANALOG1  15.41,16.8 270 top
CON_ANALOG2  20.59,16.8 270 top
CON_CAN/I2C1  3.98,21.75 270 top
CON_I2C2  37.36,26.17 180 top
CON_SPI  13.13,26.17 180 top
CON_UART1  37.43,7.43 0 top
CON_UART2  26.16,26.17 180 top
CON_UART3/5  [PB-53398-06']  25.01,7.43 0 top
CON_USB  1.62,9.33 270 top
D3  6.67,14.31 270 top
IC9  9.01,19.01 270 top
IMU  14.96,16.8 0 bottom
JTAG  30.63,12.91 270 top
L1  25.24,17.18 90 bottom
LED1  16.34,10.83 270 top
LED3  20.29,16.19 0 top
LED4  19.54,8.72 270 top
LED5  20.29,15.07 0 top
LED6  20.29,13.68 0 top
LED7  14.48,16.21 0 top
LED8  14.58,14.92 0 top
LT_I2C2  3.52,10.86 90 bottom
Q1  25.32,14.36 270 top
Q2  9.53,15.86 90 top
R1  6.6,10.63 0 top
R2  6.78,8.68 270 top
R3  2.99,10.04 90 bottom
R4  33.42,21.78 90 top
R5  33.17,24.09 270 top
R6  1.32,9.56 90 bottom
R7  28.58,16.77 180 top
R8  11.48,13.62 0 top
R9  24.49,8.65 180 bottom
R11  6.65,23.73 90 top
R12  6.57,12 0 top
R13  9,12.74 180 top
R14  8.71,13.82 180 top
R15  7.87,21.14 0 top
R16  41.78,8.87 90 top
R17  7.94,23.73 270 top
R18  7.87,22.21 0 top
R19  27.01,24.29 0 bottom
R20  25.73,22.69 90 top
R21  37.89,7.27 180 bottom
R22  38.88,6.06 0 bottom
R23  17.98,8.72 270 top
R24  42.21,11.01 270 bottom
R25  5.73,13.95 90 bottom
R26  29.06,24.29 180 bottom
R27  8.64,11.24 180 top
R28  8.15,9.69 270 top
R29  23.9,11.01 90 top
R30  16.84,8.72 90 top
R32  18.36,16.19 180 top
R33  3.2,6.19 270 bottom
R34  1.37,6.99 270 bottom
R35  18.36,15.07 180 top
R36  18.36,13.68 180 top
R37  13.49,17.26 180 top
R38  12.93,15.4 90 top
R43  2.34,14.51 90 bottom
R44  4.11,14.51 90 bottom
R55  5.44,26.55 270 bottom
R56  4.14,27.3 90 bottom
R58  4.14,25.11 90 bottom
R59  2.9,25.1 270 bottom
R60  2.97,27.28 270 bottom
R61  1.65,25.1 270 bottom
U1  3.52,20.1 0 bottom
U2  34.97,16.71 180 bottom
U3  29.51,21.3 0 top
U$1  45.97,16.8 0 top
VREG1  37.97,16.57 90 top
X1  11.91,7.43 0 top

### Tracks (layer width: path | path; a pad name or v marks a point on that pad's centre or on a via)
+3V3  (via drill 0.31)
  Top 0.152: 27.71,15.45 JTAG.1
  Top 0.305: 10.69,8.68 X1.2 v10.66,7.63 | v16.4,23.71 15.63,24.48 CON_SPI.2 | R28.P$1 8.58,10.19 9.14,10.75 9.14,11.23 R27.P$1 v9.7,11.24 | v27.3,16.75 27.3,15.87 27.71,15.45
  Top 0.406: CON_ANALOG1.2 15.65,18.67 v15.62,18.7 | U3.4 28.84,19.23 28.04,20.02 U3.3 v26.19,20.02 25.82,19.66 C8.P$2 | Q2.2 v11.67,16.81 v11.68,16.83 | CON_ANALOG2.2 v20.34,18.67 v20.34,18.68 | CON_I2C2.2 37.98,26 v37.97,26.02 | R5.P$1 32.93,24.59 v32.15,23.81 | R4.P$1 33.9,21.28 34.06,21.12 34.06,20.55 v34.08,20.53 | R29.P$1 23.9,10.48 23.95,10.42 v23.95,9.87 23.37,9.87 23.14,9.64 CON_UART3/5.2 v23.14,7.61 v23.14,7.6 | R7.P$2 27.32,16.77 v27.3,16.75 | CON_UART3/5.5 26.89,9.47 26.57,9.79 v26.52,9.79
  Top 0.61: v39.34,22.82 C36.P$1 38.49,20.6 38.42,20.53 38.42,20.46 38.5,20.38 C37.+ 39.03,19.69 38.02,18.68 38.02,17.58 38.4,17.21 VREG1.3
  Bottom 0.305: 40.67,12.96 U2.48 41.48,12.96 41.8,12.64 C12.P$2 42.21,12.62 v42.21,12.07 R24.P$1 | L1.P$1 26.98,16.43 v27.3,16.75 | v5.59,8.7 5.33,8.95 4.04,8.95 3.85,8.76 LT_I2C2.2 3.85,7.16 4.04,6.97 4.04,5.98 3.81,5.75 3.26,5.75 R33.P$2 3.19,5.67 2.19,5.67 R34.P$2 | C5.P$2 30.61,9.49 v30.61,10.02 | v30.61,10.02 30.02,10.02 29.7,9.69 C9.P$1 | U2.64 31.17,10.91 31.17,10.55 30.63,10.02 v30.61,10.02 | 28.56,24.18 R26.P$1 | R19.P$1 27.51,24.24 | C10.P$2 32.07,23.81 v32.15,23.81 32.22,23.74 U2.19 | U2.32 38.98,22.46 v39.34,22.82 39.35,22.81 | U2.1 28.68,12.96 27.74,12.02 v26.66,12.02
  Bottom 0.406: R21.P$1 v36.73,7.27 | 28.56,24.18 v28.06,23.68 27.51,24.24 | 39.35,22.81 C11.P$2 | R9.P$1 23.99,7.92 23.67,7.6 v23.14,7.6
  other vias: 38.98,17.21
  pour Route15 (isolate 0.203, rank 2): 16.38,7.4 5.21,7.45 3.63,9.03 3.65,23.58 6.12,26.5 20.07,26.5 20.07,21.93 21.59,20.41 25.65,20.41 25.65,23.2 22.86,23.2 22.86,29.04 47.04,28.99 47.04,28.38 44.6,28.38 44.52,11.74 37.89,11.74 37.89,7.91 36.82,6.94 31.52,6.94 29.46,8.98 25.15,8.98 23.37,7.2 22.61,7.2 20.95,8.85 17.78,8.85
+5V  (via drill 0.31)
  Top 0.406: 14.71,18.02 14.71,19.39 13.56,20.53 12.53,20.53 C26.P$1 10.86,21.46 10.73,21.34 C1.P$1 9.66,21.34 v9.01,20.69 | 17.83,17.42 CON_ANALOG1.3 15.3,17.42 14.71,18.02 | 17.83,17.42 17.83,17.43 18.03,17.64 20.7,17.64 20.91,17.42 CON_ANALOG2.3 | R15.P$2 8.55,21.14 v9.01,20.69 | IC9.5 9.74,19.96 v9.01,20.69 | 14.71,18.02 13.26,18.02 12.99,17.75 R37.P$2 12.98,17.25 12.98,16.52 12.93,16.47 R38.P$2 12.23,15.9 11.98,15.65 R8.P$2 | 17.83,17.42 17.86,17.39 R32.P$2 R35.P$2 R36.P$2 17.86,13.67
  Bottom 0.305: R44.P$2 4.26,15.01 4.42,15.17 5.02,15.17 R25.P$2
  Bottom 0.406: 6.35,20.69 5.38,20.69 4.52,19.83 2.89,19.83 | 6.35,20.69 v9.01,20.69 | 2.89,19.83 U1.3 | R60.P$1 4.13,27.78 R56.P$2 6,27.8 6.2,27.59 6.2,24.98 6.38,24.8 6.38,20.71 6.35,20.69 | R44.P$2 R43.P$2 C2.P$1 1.07,15.55 0.79,15.83 0.79,18.91 1.71,19.83 2.89,19.83
ADC_1  (via drill 0.31)
  Top 0.152: 21.86,16.19 CON_ANALOG2.4 20.81,16.17 LED3.C 20.47,16.52 v20.47,16.83
  Bottom 0.152: U2.11 26.53,17.96 25.9,17.33 24.63,17.33 24.1,17.87 20.9,17.87 20.47,17.43 v20.47,16.83
ADC_2  (via drill 0.31)
  Top 0.152: v23.41,14.18 22.86,14.18 22.12,14.92 CON_ANALOG2.5 20.94,14.92 LED5.C
  Bottom 0.152: U2.8 28.44,16.46 27.27,15.3 24.33,15.3 23.82,14.79 23.82,14.59 v23.41,14.18
ADC_3  (via drill 0.31)
  Top 0.152: 21.87,13.65 CON_ANALOG2.6 LED6.C | v20.42,14.31 20.42,14.05 LED6.C
  Top 0.406: LED6.C
  Bottom 0.152: U2.9 28.38,16.96 27.12,15.71 23.85,15.71 23.62,15.48 22.66,15.48 22.45,15.28 20.8,15.28 20.42,14.89 v20.42,14.32 v20.42,14.31
ADC_4  (via drill 0.31)
  Top 0.152: CON_ANALOG1.4 16.68,16.19 15.64,16.19 v15.62,16.21 LED7.C
  Bottom 0.152: U2.25 35.22,21.6 34.72,21.09 33.78,21.09 33.15,20.46 30.48,20.46 30,20.94 27.99,20.94 27.15,21.78 24.43,21.78 23.39,20.74 20.14,20.74 v15.62,16.21
ADC_6  (via drill 0.31)
  Top 0.152: LED8.C v15.67,14.92 CON_ANALOG1.5
  Bottom 0.152: U2.10 26.75,17.46 26.26,16.98 24.23,16.98 23.09,15.83 16.58,15.83 v15.67,14.92
BARO_DRDY  (via drill 0.31)
  Top 0.152: U3.2 30.04,21.3 30.35,21.6 30.35,23.84 31.74,25.23 33.78,25.23 34.46,24.55 v34.46,24.19
  Bottom 0.152: U2.26 35.72,23.31 34.84,24.19 v34.46,24.19
BOOT0  (via drill 0.31)
  Top 0.152: CON_ANALOG1.6 16.66,12.81 17.02,12.46 17.02,9.84 16.84,9.66 R30.P$2 16.24,9.22 v16.12,9.1 | CON_ANALOG1.6
  Bottom 0.152: U2.60 33.22,8.86 32.48,8.11 32.44,8.06 25.6,8.06 24.21,6.67 22.63,6.67 21.95,7.35 18.31,7.35 16.56,9.1 v16.12,9.1
CAN_CENTER
  Bottom 0.305: R58.P$2 R59.P$1 | R59.P$1 2.9,26.71 R60.P$2 | R59.P$1 R61.P$1 C42.P$2
CAN_H  (via drill 0.31)
  Top 0.406: CON_CAN/I2C1.5 3.94,20.5 v3.91,20.53
  Bottom 0.305: v3.91,20.53 4.16,20.79 U1.7 4.16,24.59 R58.P$1
CAN_L  (via drill 0.31)
  Top 0.305: CON_CAN/I2C1.4 3.37,21.75 v2.92,21.3
  Bottom 0.305: R59.P$2 U1.6 2.89,21.32 v2.92,21.3
CAN_RX
  Bottom 0.152: U2.61 32.72,9.95 32.84,9.84 32.84,9.03 32.23,8.42 32.23,8.41 32.21,8.39 25.76,8.39 25.5,8.65 R9.P$2 24.99,8.51 24.71,8.24 24.71,7.83 23.93,7.05 22.84,7.05 22.12,7.76 20.14,7.76 18.21,9.69 10.62,9.69 9.98,10.32 6.91,10.32 6.38,10.86 6.38,15.09 5.74,15.73 2.08,15.73 1.62,16.19 U1.4
CAN_TX
  Bottom 0.152: U2.62 32.22,11.75 31.97,12 31.06,12 29.48,10.42 25.2,10.42 24.66,9.89 24.66,9.74 24.21,9.28 23.6,9.28 23.29,8.98 23.29,8.37 23.11,8.19 20.31,8.19 18.38,10.12 10.74,10.12 10.21,10.65 7.06,10.65 6.72,10.99 6.72,15.52 5.43,16.81 U1.1
EXTSPI_DRDY  (via drill 0.31)
  Top 0.152: CON_SPI.7 9.38,25.77 9.88,26.27 v10.48,26.27
  Bottom 0.152: U2.27 36.22,23.4 34.82,24.8 34.27,24.8 32.46,26.6 10.81,26.6 v10.48,26.27
EXTSPI_MISO  (via drill 0.31)
  Top 0.152: CON_SPI.4 13.13,25.69 v13.43,25.99
  Bottom 0.152: U2.22 33.72,23.36 33.33,23.76 33.33,24.45 31.95,25.82 17.22,25.82 16.76,25.36 14.07,25.36 v13.43,25.99
EXTSPI_MOSI  (via drill 0.31)
  Top 0.152: CON_SPI.3 14.38,25.82 v14.55,25.99
  Bottom 0.152: U2.23 34.22,23.52 33.81,23.94 33.81,24.62 32.23,26.2 16.84,26.2 16.64,25.99 v14.55,25.99
EXTSPI_SCK  (via drill 0.31)
  Top 0.152: CON_SPI.5 11.88,25.75 12.12,25.99 v12.34,25.99
  Bottom 0.152: U2.21 33.22,23.25 32.84,23.63 32.84,24.29 31.7,25.44 17.5,25.44 16.99,24.93 13.41,24.93 v12.34,25.99
EXTSPI_SS  (via drill 0.31)
  Top 0.152: CON_SPI.6 10.63,25.22 10.79,25.38 10.79,25.69 11.1,25.99 v11.27,25.99
  Bottom 0.152: U2.20 32.72,21.66 32.33,21.27 31.01,21.27 30.5,21.78 28.37,21.78 27.46,22.69 26.11,22.69 25.48,23.33 24.54,23.33 24.46,23.25 17.8,23.25 16.56,24.49 12.77,24.49 v11.27,25.99
FT_USB_DM
  Top 0.152: CON_USB.PIN_2 4.36,9.99 5.51,9.99 6.1,10.58 R1.P$1
FT_USB_DP
  Top 0.152: CON_USB.PIN_3 5.94,9.33 6.1,9.18 R2.P$1
GND  (via drill 0.31)
  Top 0.305: CON_ANALOG2.1 21.81,19.92 | CON_SPI.1 17.07,24.72 v17.7,24.72 | v28.59,22.51 27.39,22.51 27.41,22.54 | U3.1 27.41,22.54 | 35.89,20.66 35.92,20.63 35.92,20.89 | CON_UART1.1 35.56,9.53 v35.69,9.66 | CON_USB.PIN_5 5.23,8.03 v5.43,7.83 | C8.P$1 24.82,19.99 v24.43,20.38 | C36.P$2 36.99,23.08 37.62,23.71 39.12,23.71 v39.22,23.8 | CON_I2C2.1 39.23,24.89 39.22,24.88 | 27.41,22.54 26.95,22.54 26.44,22.03
  Top 0.406: IC9.2 v9.54,19.01 | C38.P$2 40.88,12.23 v40.74,12.23 | C1.P$2 9.39,23.24 R18.P$2 | v39.22,23.8 39.22,24.88 | C35.P$2 41.09,21.22 v41.3,21.42 | C27.P$1 31.75,16.77 v32.03,16.49 | R13.P$2 8.05,12.74 v7.79,12.99 | 25.63,10.81 C4.P$1 25.66,10.83 26.59,10.83 27.05,10.37 JTAG.9 | LED4.C 20.15,8.22 20.57,8.65 v20.57,9.2 v20.57,9.21 | X1.1 9.41,7.7 v9.39,7.68 | CON_UART3/5.4 25.64,9.93 | v25.34,14.34 25.34,16.44 25.73,16.83 25.73,17.13 C6.P$2 25.76,16.85 26.29,16.32 26.29,15.61 26.31,15.58
  Top 0.61: VREG1.7 VREG1.6 | VREG1.8 35.37,13.99 36.67,12.68 | 35.68,20.53 35.37,20.22 VREG1.5 35.38,18.47 35.38,17.18 | C36.P$2 36.78,22.82 35.92,21.95 35.92,20.45 C37.- | CON_CAN/I2C1.1 6.77,25.5 v6.85,25.59
  Bottom 0.305: 40.66,13.46 U2.47 41.52,13.46 41.68,13.62 | C12.P$1 41.7,13.64 | 4.16,16.67 U1.2 | U2.18 31.72,23.25 31.39,23.58 v30.93,23.58 30.93,23.74 30.58,24.09 C10.P$1 | U2.12 30.21,18.46 v30.53,18.78 | v32.31,9.41 31.84,9.41 C5.P$1 31.72,9.37 U2.63 | U$1.P$2 44.06,26.02 v44.22,25.87 | LT_I2C2.1 5.33,7.93 v5.43,7.83 | C15.P$2 5.96,10.51 v6.57,9.89 | U2.31 38.22,23.42 38.58,23.78 39.2,23.78 v39.22,23.8 v39.22,23.81 | R55.P$1 4.94,27.05 v4.88,27.11 | C11.P$1 40.29,23.81 40.7,23.4
  Bottom 0.406: v24.43,20.38 24.44,20.39 C28.- 25.41,20.39 25.7,20.69 26.48,20.69 C31.P$1 | U1.2 4.16,18.55 v3.63,19.09 | v39.22,23.81 C11.P$1 | C9.P$2 27.2,9.41 26.92,9.13 25.93,9.13 25.63,9.43 v25.63,9.89 | v20.57,9.21 21.89,9.21 21.92,9.18
  other vias: 42.23,14.23 0.78,25.54 11.17,22.31 9.24,17.79 8.48,4.99 10.61,4.99 20.97,4.81 39.75,28.56 26.11,4.84 34.69,4.99 37.51,4.99 40.18,4.99 8.48,28.61 10.84,28.61 13.43,28.61 17.77,28.61 15.72,28.61 23.34,28.61 25.17,28.61 26.99,28.61 44.24,22.9 44.22,19.77 44.22,16.8 44.22,13.75 44.22,10.86 14.4,13.09 36.75,16.55 0.93,20.46 4.29,28.61 0.53,11.97 6.34,17.46 3.04,4.89 12.44,19.44 20.62,24.42 23.49,18.45 15.21,4.81 13.13,4.81 14.78,20.66 19.15,18.55 16.15,8.21 34.74,28.64 37.18,28.58 18.38,12.79 3.79,4.09 0.54,3.84 43.88,3.89 46.83,3.89 0.54,29.74 3.79,29.74 46.88,29.64 43.88,29.64
  pour Route2 (isolate 0.203): 0.48,4.61 0.48,28.99 47.04,28.99 47.04,28.38 44.52,28.38 44.52,5.22 47.04,5.22 47.04,4.61
  pour Bottom (isolate 0.203): 0.02,4.15 0.02,29.45 47.95,29.45 47.95,4.15
  pour Top (isolate 0.203): 0.02,29.45 42.69,29.45 42.69,27.7 47.34,27.7 47.26,5.98 42.77,5.98 42.77,4.15 0.02,4.15 0.02,22.06 4.29,22.06 4.29,25.03 0.02,25.03
  pour Top (no thermals): 0.02,25.1 1.85,25.1 1.85,21.9 0.02,21.9
I2C2_SCL  (via drill 0.31)
  Top 0.152: v36.72,26.02 36.73,26.01 CON_I2C2.3 36.73,24.14 36.27,23.68 36.07,23.68 34.66,22.28 R4.P$2 32.95,21.8 32.61,21.8 32.11,21.3 U3.6
  Bottom 0.152: IMU.P$10 9.09,14.26 10.87,16.04 10.87,21.5 10.49,21.88 10.49,25.44 9.96,25.97 9.96,26.53 10.36,26.93 34.29,26.93 35.36,25.87 36.57,25.87 v36.72,26.02 36.73,26.01 36.73,24.72 37.22,24.23 U2.29
I2C2_SDA  (via drill 0.31)
  Top 0.152: U3.7 32.53,22.56 33.17,23.2 R5.P$2 34.98,23.59 35.48,24.09 CON_I2C2.4 35.48,26.1 v35.78,26.4
  Bottom 0.152: IMU.P$11 9.29,16.8 10.26,17.76 10.26,21.4 10.06,21.6 10.06,25.36 9.6,25.82 9.6,26.65 10.24,27.29 34.89,27.29 v35.78,26.4 36.04,26.65 37.06,26.65 37.39,26.32 37.39,25 37.72,24.67 U2.30
IMU_ACC_CS
  Bottom 0.152: IMU.P$12 9.04,19.34 9.65,19.95 9.65,25.26 9.27,25.64 9.27,26.83 10.08,27.65 37.8,27.65 41.15,24.29 41.15,22.09 40.72,21.66 U2.33
IMU_ACC_DRDY  (via drill 0.31)
  Top 0.152: v34.54,25.79 29.34,25.79 29.11,26.02 29.11,27.64 v28.59,28.15
  Bottom 0.152: IMU.P$13 8.3,21.88 9.16,22.74 9.17,22.74 9.3,22.87 9.3,25.1 8.94,25.46 8.94,27.04 9.91,28 27.36,28 27.51,28.15 v28.59,28.15 | U2.28 36.72,23.61 v34.54,25.79
IMU_GYRO_DRDY
  Bottom 0.152: U2.3 28.35,13.96 27.38,12.99 19.71,12.99 19.36,13.35 15.14,13.35 14.86,13.62 13.92,13.62 13.59,13.29 9.88,13.29 8.31,11.72 IMU.P$9
IMU_GYRO_SS  (via drill 0.31)
  Top 0.152: v9.67,9.81 10.9,9.81 11.78,10.7 v11.78,12.25
  Bottom 0.152: U2.2 28.41,13.46 27.6,12.66 20.5,12.66 20.09,12.25 v11.78,12.25 | IMU.P$8 9.04,9.18 v9.67,9.81
IMU_MAG_DRDY  (via drill 0.31)
  Top 0.152: v26.44,6.77 25.96,6.77 25.02,7.71 25.02,9.54 24.66,9.89 24.66,11.19 24.34,11.51 R29.P$2 | R29.P$2 23.86,11.51 23.72,11.64 | v23.26,11.85 23.56,11.85 R29.P$2
  Bottom 0.152: U2.57 34.72,8.83 33.01,7.12 32.87,6.97 26.64,6.97 v26.44,6.77 | IMU.P$6 22.25,11.72 22.38,11.85 v23.26,11.85
IMU_SPI_MISO  (via drill 0.31)
  Top 0.152: v23.36,19.34 23.7,19.34 24.33,18.7 28.29,18.7 28.9,18.09 30.68,18.09 31.69,19.11 v32.48,19.11
  Bottom 0.152: IMU.P$3 v23.36,19.34 | U2.35 32.83,19.46 v32.48,19.11
IMU_SPI_MOSI  (via drill 0.31)
  Top 0.152: v33.04,18.55 31.72,18.55 30.93,17.76 28.62,17.76 28.11,18.27 24.3,18.27 v23.31,17.28
  Bottom 0.152: U2.36 33.45,18.96 v33.04,18.55 | v23.31,17.28 22.42,17.28 IMU.P$4
IMU_SPI_SCK  (via drill 0.31)
  Top 0.152: v23.21,14.97 23.21,16.32 23.95,17.05 23.95,17.41 24.38,17.84 27.86,17.84 28.27,17.43 31.46,17.43 v32.05,18.02
  Bottom 0.152: IMU.P$5 21.94,14.23 22.25,14.23 22.99,14.97 v23.21,14.97 | U2.34 32.32,19.96 31.95,19.6 31.95,18.78 32.05,18.68 v32.05,18.02
JTAG_RST  (via drill 0.31)
  Top 0.152: JTAG.10 31.17,10.37 30.66,10.88 v30.66,15.94 30.29,16.3 C27.P$2 R7.P$1
  Bottom 0.152: v30.66,15.94 30.63,15.96 U2.7
JTAG_TCK  (via drill 0.31)
  Top 0.152: v34.44,13.83 34.14,13.83 33.78,14.18 JTAG.4
  Bottom 0.152: U2.49 38.72,11.83 37.77,12.79 35.94,12.79 34.9,13.83 v34.44,13.83
JTAG_TDI  (via drill 0.31)
  Top 0.152: JTAG.8 34.27,11.64 34.9,11.01 37.19,11.01 v38.33,9.87
  Bottom 0.152: v38.33,9.87 38.25,9.94 38.25,10.94 U2.50
JTAG_TDO  (via drill 0.31)
  Top 0.152: JTAG.6 v34.37,12.91
  Bottom 0.152: U2.55 35.72,11.94 34.75,12.91 v34.37,12.91
JTAG_TMS  (via drill 0.31)
  Top 0.152: v37.28,14.67 36.67,15.28 32.84,15.28 JTAG.2
  Bottom 0.152: U2.46 37.98,13.96 v37.28,14.67
JTAG_TRST  (via drill 0.31)
  Top 0.152: X1.5 14.41,8.96 15.04,9.59 15.59,9.59 LED1.C | X1.5 14.4,8.67 | X1.5 14.41,6.96 v14.96,6.41
  Bottom 0.152: U2.56 35.22,10.14 35.12,10.04 35.12,8.69 33.05,6.61 27.17,6.61 26.71,6.16 25.27,6.16 24.71,5.6 22.07,5.6 21.49,6.18 15.18,6.18 v14.96,6.41
LT_I2C1_SCL  (via drill 0.31)
  Top 0.152: CON_CAN/I2C1.6 4.68,19.25 3.91,18.48 3.91,17.08 4.21,16.78 4.21,15.05 v4.85,14.41
  Bottom 0.152: R3.P$2 3.2,11 LT_I2C2.6 3.2,12.91 3.5,13.22 3.89,13.22 4.12,13.45 R44.P$1 | R44.P$1 4.12,14.01 4.37,14.26 | v4.85,14.41 4.51,14.41 R44.P$1
LT_I2C1_SDA  (via drill 0.31)
  Top 0.152: v3.25,13.9 4.42,13.9 4.57,13.75 5.03,13.75 5.41,14.13 5.41,15.07 4.67,15.81 4.67,17.87 4.81,18 CON_CAN/I2C1.7
  Bottom 0.152: R6.P$2 1.31,11.61 1.83,12.13 LT_I2C2.5 2.55,13.13 2.34,13.35 R43.P$1 3.14,14.01 v3.25,13.9
N$1
  Bottom 0.406: U1.8 R55.P$2 4.87,26.05 R56.P$1
N$2  (via drill 0.31)
  Top 0.305: CON_UART2.2 26.78,23.9 v26.51,23.63 26.18,23.63 R20.P$2
  Bottom 0.305: v26.51,23.63 v26.51,23.64
  Bottom 0.406: v26.51,23.64 R19.P$2
N$3  (via drill 0.31)
  Top 0.305: CON_UART1.2 36.82,8.66 36.82,8.17 37.69,7.3 37.71,7.3 v38.35,6.67
  Bottom 0.305: 38.35,7.23 R21.P$2
  Bottom 0.406: R22.P$2 38.38,6.63 v38.35,6.67 38.35,7.23
N$5
  Top 0.152: LED3.A R32.P$1
N$6
  Top 0.406: IC9.4 11.38,18.06 C13.P$1
N$7
  Top 0.406: C35.P$1 41.09,18.58 41.1,18.58 40.67,18.58 VREG1.4
N$8
  Bottom 0.254: LT_I2C2.8 LT_I2C2.7
  Bottom 0.305: R25.P$1 C15.P$1 5.74,12.13 LT_I2C2.8
N$9
  Top 0.152: LED5.A R35.P$1
N$10
  Top 0.152: R8.P$1 10.98,13.46 11.23,13.22 11.23,12.99 11.35,12.86 13.39,12.86 13.69,12.56 15.72,12.56 16.34,11.94 LED1.A
N$11
  Top 0.152: LED6.A R36.P$1
N$12
  Top 0.406: R23.P$1 LED4.A
N$13
  Top 0.152: R14.P$2 8.21,15.65 Q2.3
N$14
  Top 0.152: LED7.A 13.98,17.25 R37.P$1
N$15
  Top 0.152: R38.P$1 14.06,14.9 LED8.A
NC_1
  pour Top (no thermals): 43.15,29.14 47.34,29.14 47.34,28.15 43.15,28.15
OSC_IN  (via drill 0.31)
  Top 0.152: v26.3,14.29 v26.29,14.28 Q1.P$3 26.29,13.02 25.65,12.38 C4.P$2
  Bottom 0.152: U2.5 28.23,14.96 27.55,14.29 v26.3,14.29
OSC_OUT  (via drill 0.31)
  Top 0.152: v24.48,14.49 24.34,14.62 Q1.P$1 24.34,16.75 C6.P$1
  Bottom 0.152: U2.6 28.05,15.46 27.48,14.89 24.89,14.89 v24.48,14.49
PC10  (via drill 0.31)
  Top 0.152: X1.3 11.91,5.75 v12.03,5.62
  Bottom 0.152: U2.51 37.72,9.16 33.32,4.76 27.15,4.76 27.15,4.77 26.54,5.37 25.58,5.37 25.07,4.86 21.74,4.86 21.18,5.42 12.24,5.42 v12.03,5.62
PC12  (via drill 0.31)
  Top 0.152: X1.4 13.16,6.46 v13.43,6.18
  Bottom 0.152: U2.53 36.72,9.23 32.96,5.47 28.27,5.47 27.76,5.98 27.13,5.98 26.92,5.78 25.45,5.78 24.89,5.22 21.92,5.22 21.31,5.83 13.79,5.83 v13.43,6.18
SERVO_1  (via drill 0.31)
  Top 0.152: U$1.P$11 43.77,27.3 43.43,26.96 43.43,26.23 v42.54,25.33
  Bottom 0.203: v42.54,25.33 42.06,24.85 42.06,18.91 41.61,18.46 U2.37
SERVO_2  (via drill 0.31)
  Top 0.152: U$1.P$10 42.8,24.3 v42.77,24.27
  Bottom 0.203: U2.38 41.88,17.96 42.54,18.63 42.54,24.04 v42.77,24.27
SERVO_3  (via drill 0.31)
  Top 0.152: U$1.P$9 43.76,21.3 43.38,20.91 43.38,20.54 v43.2,20.35
  Top 0.203: U$1.P$9
  Bottom 0.203: U2.39 42.09,17.46 43.2,18.58 v43.2,20.35
SERVO_4  (via drill 0.31)
  Top 0.152: 43.51,18.3 43.51,18.27 43.02,17.78 v43.02,17.43
  Top 0.203: 43.51,18.3 U$1.P$8
  Bottom 0.203: U2.40 42.55,16.96 v43.02,17.43
SERVO_5  (via drill 0.31)
  Top 0.152: v38.91,18.02 39.06,17.87 41.78,17.87 42.09,17.56 42.09,16.93 43.72,15.3 U$1.P$7
  Bottom 0.152: v38.91,18.02 38.42,18.02 37.48,17.08 31.59,17.08 31.11,17.56 31.11,19.03 30.69,19.46 U2.14
SERVO_6  (via drill 0.31)
  Top 0.152: v37.05,17.69 37.05,17.46 37.99,16.52 41.86,16.52 42.19,16.19 42.19,15.2 42.84,14.54 42.84,13.52 43.36,13.01 43.36,12.63 43.69,12.3 U$1.P$6
  Bottom 0.152: v37.05,17.69 33.6,17.69 33.4,17.48 31.8,17.48 31.49,17.79 31.49,19.37 30.89,19.96 U2.15
SERVO_7/I2C1_SCL  (via drill 0.31)
  Top 0.152: U$1.P$5 43.77,9.3 43.43,9.64 43.43,10.55 42.67,11.31 v41,11.31
  Bottom 0.152: v41,11.31 40.46,11.31 38.48,13.29 36.27,13.29 35.18,14.39 34.16,14.39 33.81,14.03 33.81,12.35 34.21,11.95 34.21,10.97 U2.58 34.22,8.86 32.86,7.5 32.72,7.35 25.93,7.35 24.54,5.95 22.28,5.95 21.67,6.56 16.05,6.56 15.65,6.97 7.29,6.97 6.19,8.07 6.19,8.91 5.66,9.43 3.71,9.43 3.58,9.31 3,9.31 R3.P$1 3,9.28 3,8.82 3.2,8.63 LT_I2C2.3 R33.P$1 | R33.P$1
SERVO_8/I2C1_SDA
  Bottom 0.152: U2.59 33.72,8.85 32.71,7.83 32.61,7.73 25.78,7.73 24.36,6.31 22.43,6.31 21.79,6.94 16.36,6.94 14.66,8.65 9.53,8.65 9.04,8.16 6.75,8.16 6.6,8.31 6.6,9.05 5.84,9.81 4.74,9.81 4.54,10.02 2.31,10.02 2.11,9.81 2.11,9.46 1.46,8.81 R6.P$1 1.31,8.14 1.4,8.06 1.4,7.52 R34.P$1 1.39,7.5 2.46,7.5 2.55,7.59 LT_I2C2.4
SERVO_BUS
  Top 0.61: U$1.P$3 44.06,7.48 43.54,8.01 42.95,8.01 42.59,8.37 R16.P$1
  pour Top (no thermals): 43.23,4.45 47.26,4.45 47.26,5.45 43.23,5.45
UART1_RX  (via drill 0.31)
  Top 0.152: v39.32,9.79 CON_UART1.4
  Bottom 0.152: U2.43 42.2,15.46 43.15,14.51 43.15,10.93 42.77,10.55 42.26,10.55 R24.P$2 40.65,10.51 39.93,9.79 v39.32,9.79
UART1_TX  (via drill 0.31)
  Top 0.152: 38.12,8.62 38.12,7.79 38.41,7.5 39.78,7.5 40.16,7.88 40.16,8.72 v40.39,8.95
  Top 0.203: CON_UART1.3 38.12,8.62
  Bottom 0.152: U2.42 42.23,15.96 43.53,14.67 43.53,10.63 41.85,8.95 v40.39,8.95
UART2_RX  (via drill 0.31)
  Top 0.152: CON_UART2.4 23.54,24.92 v23.49,24.88
  Bottom 0.152: U2.17 30.81,22.46 29.57,23.71 R26.P$2 29.54,24.31 29.54,24.72 29.26,25 23.62,25 v23.49,24.88
UART2_TX  (via drill 0.31)
  Top 0.152: CON_UART2.3 25.53,24.12 24.28,22.88 24.28,21.68 v24.71,21.25 v24.71,21.24
  Bottom 0.152: U2.16 27.86,20.46 27.08,21.24 v24.71,21.24
UART3_RX  (via drill 0.31)
  Top 0.152: v27.4,5.45 27,5.85 25.98,5.85 24.38,7.45 CON_UART3/5.3
  Bottom 0.152: U2.52 37.22,9.2 33.14,5.12 27.73,5.12 v27.4,5.45
UART5_RX  (via drill 0.31)
  Top 0.152: CON_UART3/5.6 28.14,6.51 v28.57,6.08
  Bottom 0.152: U2.54 36.22,9.26 33.04,6.08 v28.57,6.08
USB_DETECT  (via drill 0.31)
  Top 0.152: v10.21,12.43 9.9,12.74 R13.P$1 9.2,12.43 9.2,12.23 9.09,12.13 8.38,12.13 8.26,12 R12.P$2
  Bottom 0.152: v10.21,12.43 10.69,12.43 11.68,11.44 20.11,11.44 20.77,10.78 23.04,10.78 23.72,11.46 28.95,11.46 33.42,15.94 37.01,15.94 37.54,16.46 U2.41
USB_DISC  (via drill 0.31)
  Top 0.152: v10.13,14.03 10.13,14.41 Q2.1
  Bottom 0.152: U2.4 28.29,14.46 27.15,13.32 20.32,13.32 19.61,14.03 v10.13,14.03
USB_DM  (via drill 0.31)
  Top 0.152: v10.48,11.41 10.1,11.79 8.7,11.79 R27.P$2 7.71,11.24 R1.P$2
  Bottom 0.152: U2.44 39.09,14.96 38.48,15.58 38.48,15.59 33.58,15.59 29.1,11.11 23.88,11.11 23.19,10.42 20.49,10.42 19.91,11.01 11.56,11.01 11.15,11.41 v10.48,11.41
USB_DP  (via drill 0.31)
  Top 0.152: R2.P$2 7.14,8.18 R28.P$2 8.29,9.19 9.58,10.48 10.69,10.48 v10.97,10.75 11.05,10.84 11.05,11.69 10.77,11.97 10.77,12.74 10.11,13.4 9.58,13.4 9.21,13.76 R14.P$1
  Bottom 0.152: U2.45 38.55,14.46 37.79,15.22 33.73,15.22 29.28,10.78 24.08,10.78 23.39,10.09 20.21,10.09 19.81,10.5 11.22,10.5 v10.97,10.75
USB_VBUS
  Top 0.254: CON_USB.PIN_1 4.75,10.63
  Top 0.305: 4.75,10.63 5.03,10.63 5.38,10.98 5.38,11.31 R12.P$1 6.07,12.91 D3.A
V_BAT
  Top 0.305: R11.P$2 R17.P$1
  Top 0.406: 3.22,24.27 3.23,24.25 CON_CAN/I2C1.2 5.1,24.23 R11.P$2
  pour Top (no thermals): 2.31,24.65 2.31,23.73 3.91,23.73 3.91,24.65
V_BAT_MEAS  (via drill 0.31)
  Top 0.152: R18.P$1 7.37,22.66 R17.P$2 8.44,23.23 9.1,23.89 15.46,23.89 16.05,23.31 v16.05,22.82
  Bottom 0.152: U2.24 34.72,21.76 34.41,21.45 33.45,21.45 32.87,20.86 30.79,20.86 30.3,21.35 28.17,21.35 27.3,22.21 25.86,22.21 25.15,22.92 24.69,22.92 24.59,22.82 v16.05,22.82
V_IN  (via drill 0.31)
  Top 0.152: C39.+ 39.11,12.66 39.62,12.15
  Top 0.305: C39.+ 38.73,12.3 | D3.C 6.87,15.3 C3.P$1
  Top 0.406: C39.+ 39.11,12.18 | 3.15,23 CON_CAN/I2C1.3 6.42,23 R11.P$1 6.65,21.38 6.88,21.14 R15.P$1 7.37,20.84 7.71,20.49 IC9.1 6.76,19.96 6.5,19.7 6.5,18.5 6.94,18.06 IC9.3 7.72,18.05 7.72,17.48 6.87,16.63 C3.P$1 | 3.15,23 3.1,23 3.07,22.97 | R20.P$1 25.02,22.19 v24.92,22.29 | C38.P$1 41.27,14.59 41.2,14.67 VREG1.1 | 3.15,23 2.52,22.37 2.52,21.83 2.08,21.4 v2.08,21.02 | R23.P$2 18.69,8.22 v18.75,8.16
  Top 0.508: VREG1.1 VREG1.2
  Top 0.61: C39.+ 39.11,14.28 39.5,14.67 VREG1.1 | v39.62,10.88 39.62,12.15 | R16.P$2 41.77,9.37 v41.3,9.84
  Bottom 0.305: R22.P$1 39.4,6.07
  Bottom 0.406: 21.31,21.88 IMU.P$2 23.46,21.88 v23.49,21.85 | 39.4,6.07 v39.4,6.67
  pour Top (no thermals): 2.31,23.35 2.31,22.44 3.91,22.44 3.91,23.35
  pour Route15 (isolate 0.203): 44.45,11.26 44.45,4.66 0.51,4.66 0.51,29.04 22.35,29.04 22.35,22.69 25.15,22.69 25.15,20.91 21.84,20.91 20.57,22.18 20.57,27.01 5.84,27.01 3.1,23.66 3.02,8.77 4.8,6.97 16.66,6.97 18.11,8.42 20.88,8.42 22.61,6.69 23.62,6.69 25.4,8.47 29.21,8.47 31.24,6.44 37.08,6.44 38.35,7.71 38.35,11.26
VDDA
  Bottom 0.305: U2.13 28.13,18.96 27.98,19.12 C31.P$2 26.45,19.12 26.2,18.87 25.24,18.87 | C28.+ 25.24,18.87 | 25.24,18.87 L1.P$2

### Text on the board
Top: LISA_M_V1_R0 TOP LAYER
Route2: LISA_M_V1_R0 LAYER 2
Route15: LISA_M_V1_R0 LAYER 3
Bottom: LISA_M_V1_R0 BOTTOM LAYER
tPlace: LISA_M_V1_R0 SILK SCREEN TOP | SPI1 | UART2 | I2C2 | S1 | BAT | Lisa/M | S2 | V1.0 | (C)JR | CL | ALOG2 | 2011 | S3 | CAN | CH | CL | DA | S4 | I2C1 | ALOG1 | S5 | REG3V3 | S6 | LVIN | S7 | USB | JTAG | V_S | GPIO | UART1 | RC RX
bPlace: LISA_M_V1_R0 SILK SCREEN BOTTOM | SDA | SCL | 3V3 | DRDY | SS | SCK | MISO | MOSI | 3V3 | GND | RX | TX | VCC | GND | SPI1 | Lisa/M | GND | UART2 | v1.0 | S1 | 2011 | (C)JR | I2C2 | I2C1CAN | GND | GND | 3V3 | S2 | ACC_DRDY | V_IN | ASPIRIN_IMU | ACC_CS | MISO | S3 | SDA | MOSI | S4 | SCL | SCK | S5 | GYRO_DRDY | USB | MAG_DRDY | S6 | GYRO_SS | GND | GND | VCC | TX | RX | RC RX | 3V3 | V_IN | S7 | GPIO | GND | 3V3 | RX3 | GND | 3V3 | RX5 | UART1 | GND | 3V3 | PC10 | PC12 | TRST
tNames: L1 | L2 | L3
tStop: LISA_M_V1_R0 SOLDER MASK TOP
bStop: LISA_M_V1_R0 SOLDER MASK BOTTOM
tCream: LISA_M_V1_R0 SOLDER PASTE TOP
bCream: LISA_M_V1_R0 SOLDER PASTE BOTTOM
Measures: 47mm | 25.3mm
Reference: CC-BY-SA
DrillLegend: LISA_M_V1_R0 DRILL LEGEND